# EAGLE design BlackBoard-Artemis-ATP (EAGLE 9.4.0)

## Sheet 1 of 2
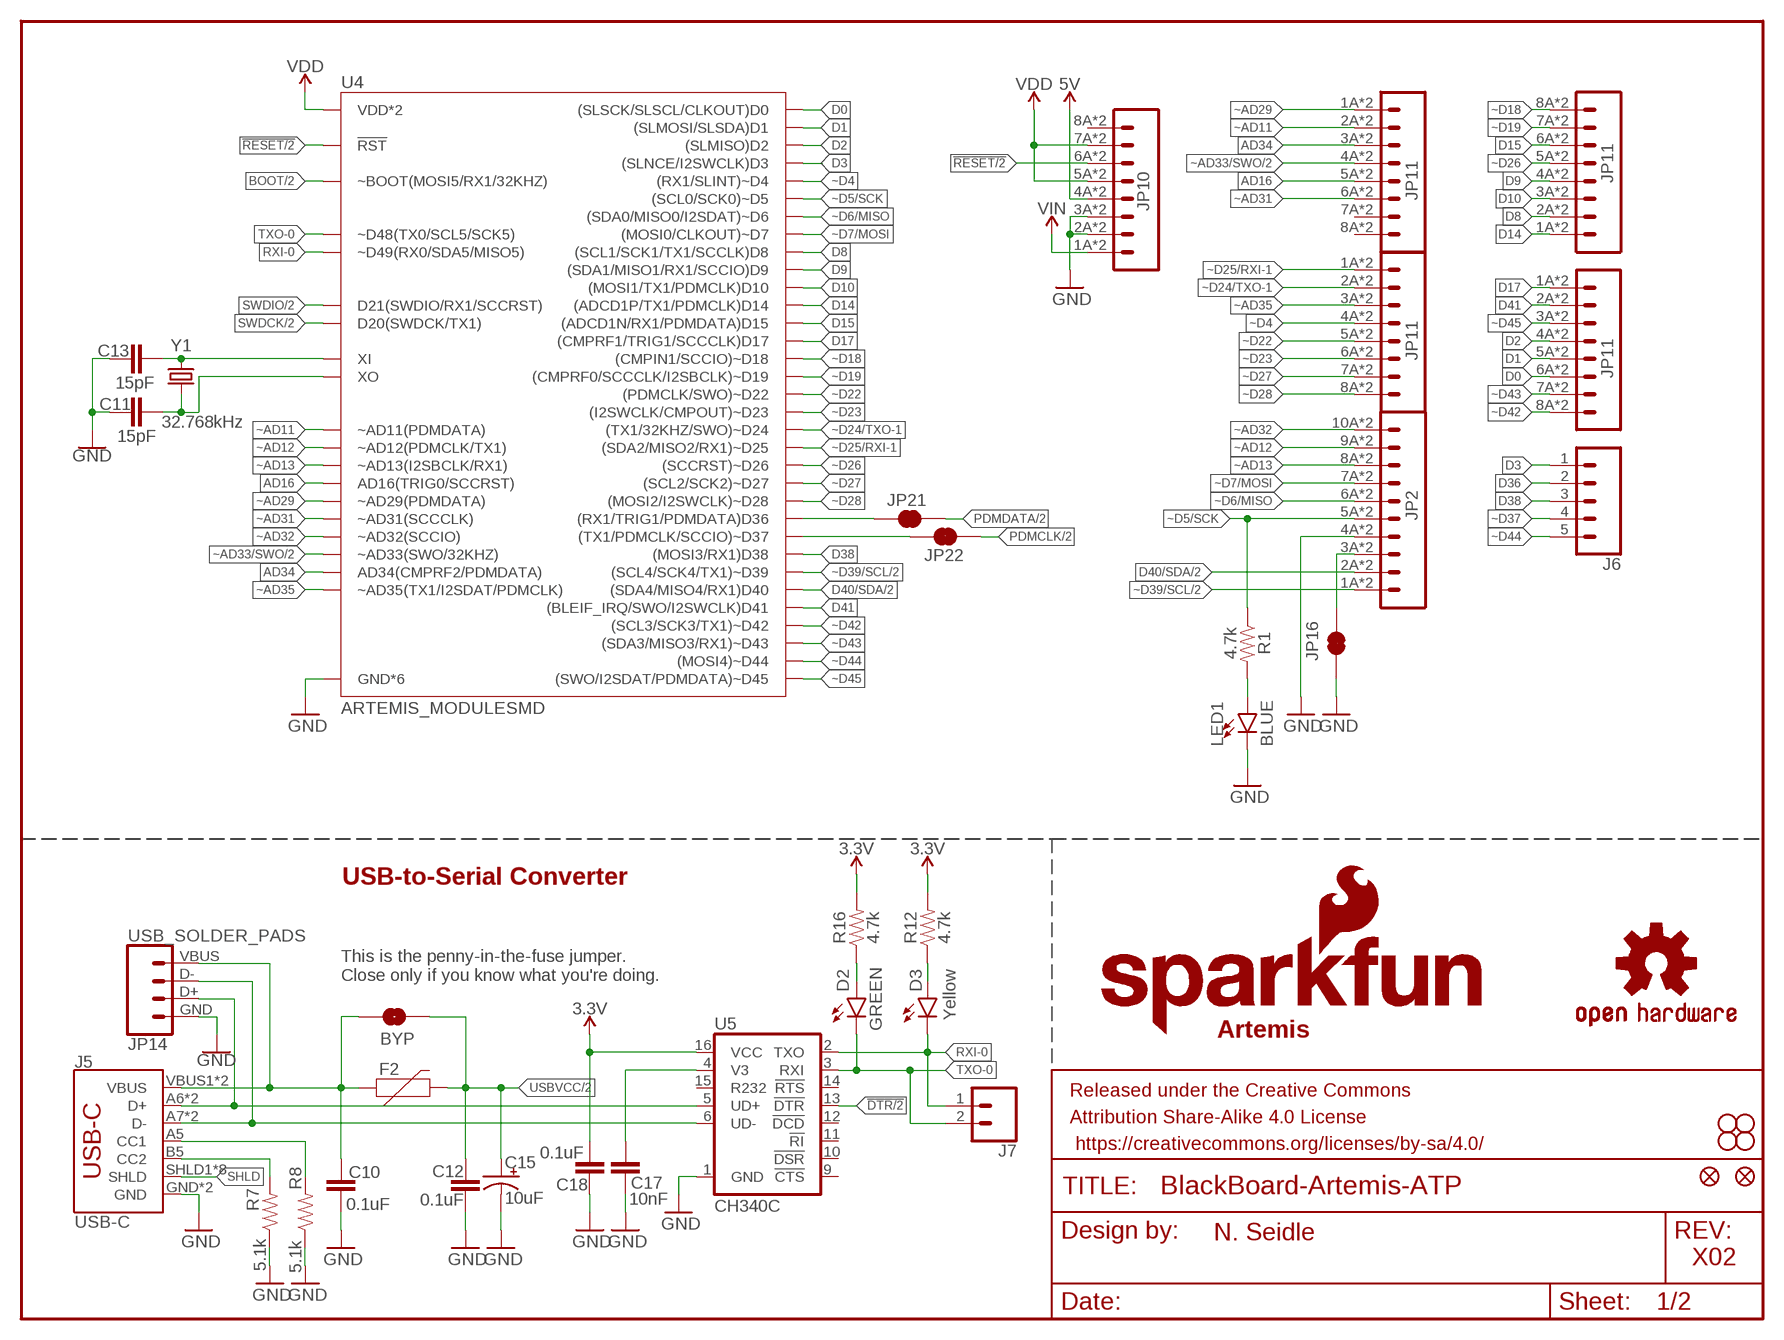
[diagram p0: schematic, sheet 1]

### Parts
BYP  BYP  JUMPER-SMT_2_NO_SILK  [SMT-JUMPER_2_NO_SILK]
C10  0.1uF  0.1UF-0603-25V-(+80/-20%)  [0603]
C11  15pF  15PF-0603-50V-5%  [0603]
C12  0.1uF  0.1UF-0603-25V-(+80/-20%)  [0603]
C13  15pF  15PF-0603-50V-5%  [0603]
C15  10uF  10UF-POLAR-EIA3216-16V-10%(TANT)  [EIA3216]
C17  10nF  10NF-0603-50V-10%  [0603]
C18  0.1uF  0.1UF-0603-25V-(+80/-20%)  [0603]
D2  GREEN  LED-GREENLILYPAD  [LED-1206]
D3  Yellow  LED-YELLOWLILYPAD  [LED-1206]
F2  6V/2A  PPTC_6V2A  [1210]
FRAME1  FRAME-LETTER  [CREATIVE_COMMONS]
J5  USB-C  USB_C  [USB-C-16P]
J6  CONN_05NO_SILK  [1X05_NO_SILK]
J7  CONN_021X02_NO_SILK  [1X02_NO_SILK]
JP1  SFE_LOGO_NAME.1_INCH  [SFE_LOGO_NAME_.1]
JP2  M10SMD_COMBO  [1X10_SMD_COMBINED]
JP3  STAND-OFF  [STAND-OFF]
JP4  STAND-OFF  [STAND-OFF]
JP5  STAND-OFF  [STAND-OFF]
JP6  STAND-OFF  [STAND-OFF]
JP7  SFE_LOGO_FLAME.1_INCH  [SFE_LOGO_FLAME_.1]
JP8  FIDUCIAL1X2  [FIDUCIAL-1X2]
JP9  FIDUCIAL1X2  [FIDUCIAL-1X2]
JP10  M08SMD-COMBO  [1X08_SMD_COMBINED]
JP11  JP11  M08SMD-COMBO  [1X08_SMD_COMBINED]
JP13  JP11  M08SMD-COMBO  [1X08_SMD_COMBINED]
JP14  USB_SOLDER_PADS  [USB-SOLDER-PADS]
JP16  JUMPER-SMT_2_NC_TRACE_SILK  [SMT-JUMPER_2_NC_TRACE_SILK]
JP19  JP11  M08SMD-COMBO  [1X08_SMD_COMBINED]
JP20  JP11  M08SMD-COMBO  [1X08_SMD_COMBINED]
JP21  JUMPER-SMT_2_NC_TRACE_SILK  [SMT-JUMPER_2_NC_TRACE_SILK]
JP22  JUMPER-SMT_2_NC_TRACE_SILK  [SMT-JUMPER_2_NC_TRACE_SILK]
LED1  BLUE  LED-BLUE1206  [LED-1206]
R1  4.7k  4.7KOHM-0603-1/10W-1%  [0603]
R7  5.1k  5.1KOHM5.1KOHM-0603-1/10W-1%  [0603]
R8  5.1k  5.1KOHM5.1KOHM-0603-1/10W-1%  [0603]
R12  4.7k  4.7KOHM-0603-1/10W-1%  [0603]
R16  4.7k  4.7KOHM-0603-1/10W-1%  [0603]
U4  ARTEMIS_MODULESMD  [ARTEMIS_FP]
U5  CH340C  [SO016]
U$16  OSHW-LOGOS  [OSHW-LOGO-S]
Y1  32.768kHz  CRYSTAL-32.768KHZSMD-3.2X1.5  [CRYSTAL-SMD-3.2X1.5MM]

### Nets
3.3V: C18.1 R12.2 R16.2 U5.16(VCC) ; also sheet 2
5V [power]: JP10.4A JP10.4B ; also sheet 2
!DTR: U5.13(!DTR) ; also sheet 2
!RESET: JP10.6A JP10.6B U4.~RST(!RST) ; also sheet 2
AD16: JP13.5A JP13.5B U4.AD16(AD16(TRIG0/SCCRST))
AD34: JP13.3A JP13.3B U4.AD34(AD34(CMPRF2/PDMDATA))
BOOT: U4.BOOT(~BOOT(MOSI5/RX1/32KHZ)) ; also sheet 2
CC1: J5.A5(CC1) R8.2
CC2: J5.B5(CC2) R7.2
D0: JP20.6A JP20.6B U4.D0((SLSCK/SLSCL/CLKOUT)D0)
D1: JP20.5A JP20.5B U4.D1((SLMOSI/SLSDA)D1)
D2: JP20.4A JP20.4B U4.D2((SLMISO)D2)
D3: J6.1 U4.D3((SLNCE/I2SWCLK)D3)
D8: JP19.2A JP19.2B U4.D8((SCL1/SCK1/TX1/SCCLK)D8)
D9: JP19.4A JP19.4B U4.D9((SDA1/MISO1/RX1/SCCIO)D9)
D10: JP19.3A JP19.3B U4.D10((MOSI1/TX1/PDMCLK)D10)
D14: JP19.1A JP19.1B U4.D14((ADCD1P/TX1/PDMCLK)D14)
D15: JP19.6A JP19.6B U4.D15((ADCD1N/RX1/PDMDATA)D15)
D17: JP20.1A JP20.1B U4.D17((CMPRF1/TRIG1/SCCCLK)D17)
D36: J6.2 JP21.1 U4.D36((RX1/TRIG1/PDMDATA)D36)
D38: J6.3 U4.D38((MOSI3/RX1)D38)
D40/SDA: JP2.2A JP2.2B U4.D40((SDA4/MISO4/RX1)D40) ; also sheet 2
D41: JP20.2A JP20.2B U4.D41((BLEIF_IRQ/SWO/I2SWCLK)D41)
D+: J5.A6(D+) J5.B6(D+) JP14.D+ U5.5(UD+)
D-: J5.A7(D-) J5.B7(D-) JP14.D- U5.6(UD-)
GND: C10.2 C11.1 C12.2 C13.1 C15.- C17.2 C18.2 J5.GND J5.GND2(GND) JP2.4A JP2.4B JP10.2A JP10.2B JP10.3A JP10.3B JP14.GND JP16.1 LED1.C R7.1 R8.1 U4.GND@1(GND*6) U4.GND@22(GND*6) U4.GND@38(GND*6) U4.GND@39(GND*6) U4.GND@47(GND*6) U4.GND@59(GND*6) U5.1(GND) ; also sheet 2
N$1: LED1.A R1.2
N$5: D2.A R16.1
N$6: C17.1 U5.4(V3)
N$7: C11.2 U4.XO Y1.P$2
N$8: C13.2 U4.XI Y1.P$1
N$9: D3.A R12.1
N$10: JP2.3A JP2.3B JP16.2
PDMCLK: JP22.2 ; also sheet 2
PDMDATA: JP21.2 ; also sheet 2
RXI-0: D3.C J7.1 U4.RXI-0(~D49(RX0/SDA5/MISO5)) U5.2(TXO)
SHLD: J5.SHLD1(SHLD) J5.SHLD2(SHLD) J5.SHLD3(SHLD) J5.SHLD4(SHLD) J5.SHLD5(SHLD) J5.SHLD6(SHLD) J5.SHLD7(SHLD) J5.SHLD8(SHLD)
SWDCK: U4.SWDCK(D20(SWDCK/TX1)) ; also sheet 2
SWDIO: U4.SWDIO(D21(SWDIO/RX1/SCCRST)) ; also sheet 2
TXO-0: D2.C J7.2 U4.TXO-0(~D48(TX0/SCL5/SCK5)) U5.3(RXI)
USBVCC [power]: BYP.2 C12.1 C15.+ F2.2 ; also sheet 2
VDD: JP10.5A JP10.5B JP10.7A JP10.7B U4.VDD@36(VDD*2) U4.VDD@37(VDD*2) ; also sheet 2
VIN [power]: JP10.1A JP10.1B ; also sheet 2
VUSB [power]: BYP.1 C10.1 F2.1 J5.VBUS1(VBUS) J5.VBUS2(VBUS) JP14.VBUS
~AD11: JP13.2A JP13.2B U4.~AD11(~AD11(PDMDATA))
~AD12: JP2.9A JP2.9B U4.~AD12(~AD12(PDMCLK/TX1))
~AD13: JP2.8A JP2.8B U4.~AD13(~AD13(I2SBCLK/RX1))
~AD29: JP13.1A JP13.1B U4.~AD29(~AD29(PDMDATA))
~AD31: JP13.6A JP13.6B U4.~AD31(~AD31(SCCCLK))
~AD32: JP2.10A JP2.10B U4.~AD32(~AD32(SCCIO))
~AD33/SWO: JP13.4A JP13.4B U4.~AD33/SWO(~AD33(SWO/32KHZ)) ; also sheet 2
~AD35: JP11.3A JP11.3B U4.~AD35(~AD35(TX1/I2SDAT/PDMCLK))
~D4: JP11.4A JP11.4B U4.~D4((RX1/SLINT)~D4)
~D5/SCK: JP2.5A JP2.5B R1.1 U4.~D5((SCL0/SCK0)~D5)
~D6/MISO: JP2.6A JP2.6B U4.~D6((SDA0/MISO0/I2SDAT)~D6)
~D7/MOSI: JP2.7A JP2.7B U4.D7((MOSI0/CLKOUT)~D7)
~D18: JP19.8A JP19.8B U4.~D18((CMPIN1/SCCIO)~D18)
~D19: JP19.7A JP19.7B U4.~D19((CMPRF0/SCCCLK/I2SBCLK)~D19)
~D22: JP11.5A JP11.5B U4.~D22((PDMCLK/SWO)~D22)
~D23: JP11.6A JP11.6B U4.~D23((I2SWCLK/CMPOUT)~D23)
~D24/TXO-1: JP11.2A JP11.2B U4.~D24((TX1/32KHZ/SWO)~D24)
~D25/RXI-1: JP11.1A JP11.1B U4.~D25((SDA2/MISO2/RX1)~D25)
~D26: JP19.5A JP19.5B U4.~D26((SCCRST)~D26)
~D27: JP11.7A JP11.7B U4.~D27((SCL2/SCK2)~D27)
~D28: JP11.8A JP11.8B U4.~D28((MOSI2/I2SWCLK)~D28)
~D37: J6.4 JP22.1 U4.~D37((TX1/PDMCLK/SCCIO)~D37)
~D39/SCL: JP2.1A JP2.1B U4.~D39((SCL4/SCK4/TX1)~D39) ; also sheet 2
~D42: JP20.8A JP20.8B U4.~D42((SCL3/SCK3/TX1)~D42)
~D43: JP20.7A JP20.7B U4.~D43((SDA3/MISO3/RX1)~D43)
~D44: J6.5 U4.~D44((MOSI4)~D44)
~D45: JP20.3A JP20.3B U4.~D45((SWO/I2SDAT/PDMDATA)~D45)
Unconnected: JP10.8A JP10.8B JP13.7A JP13.7B JP13.8A JP13.8B U5.9(!CTS) U5.10(!DSR) U5.11(!RI) U5.12(!DCD) U5.14(!RTS) U5.15(R232)

### Notes on the sheet
- USB-to-Serial Converter
- This is the penny-in-the-fuse jumper.
  Close only if you know what you're doing.
- Artemis
- N. Seidle
- X02

## Sheet 2 of 2
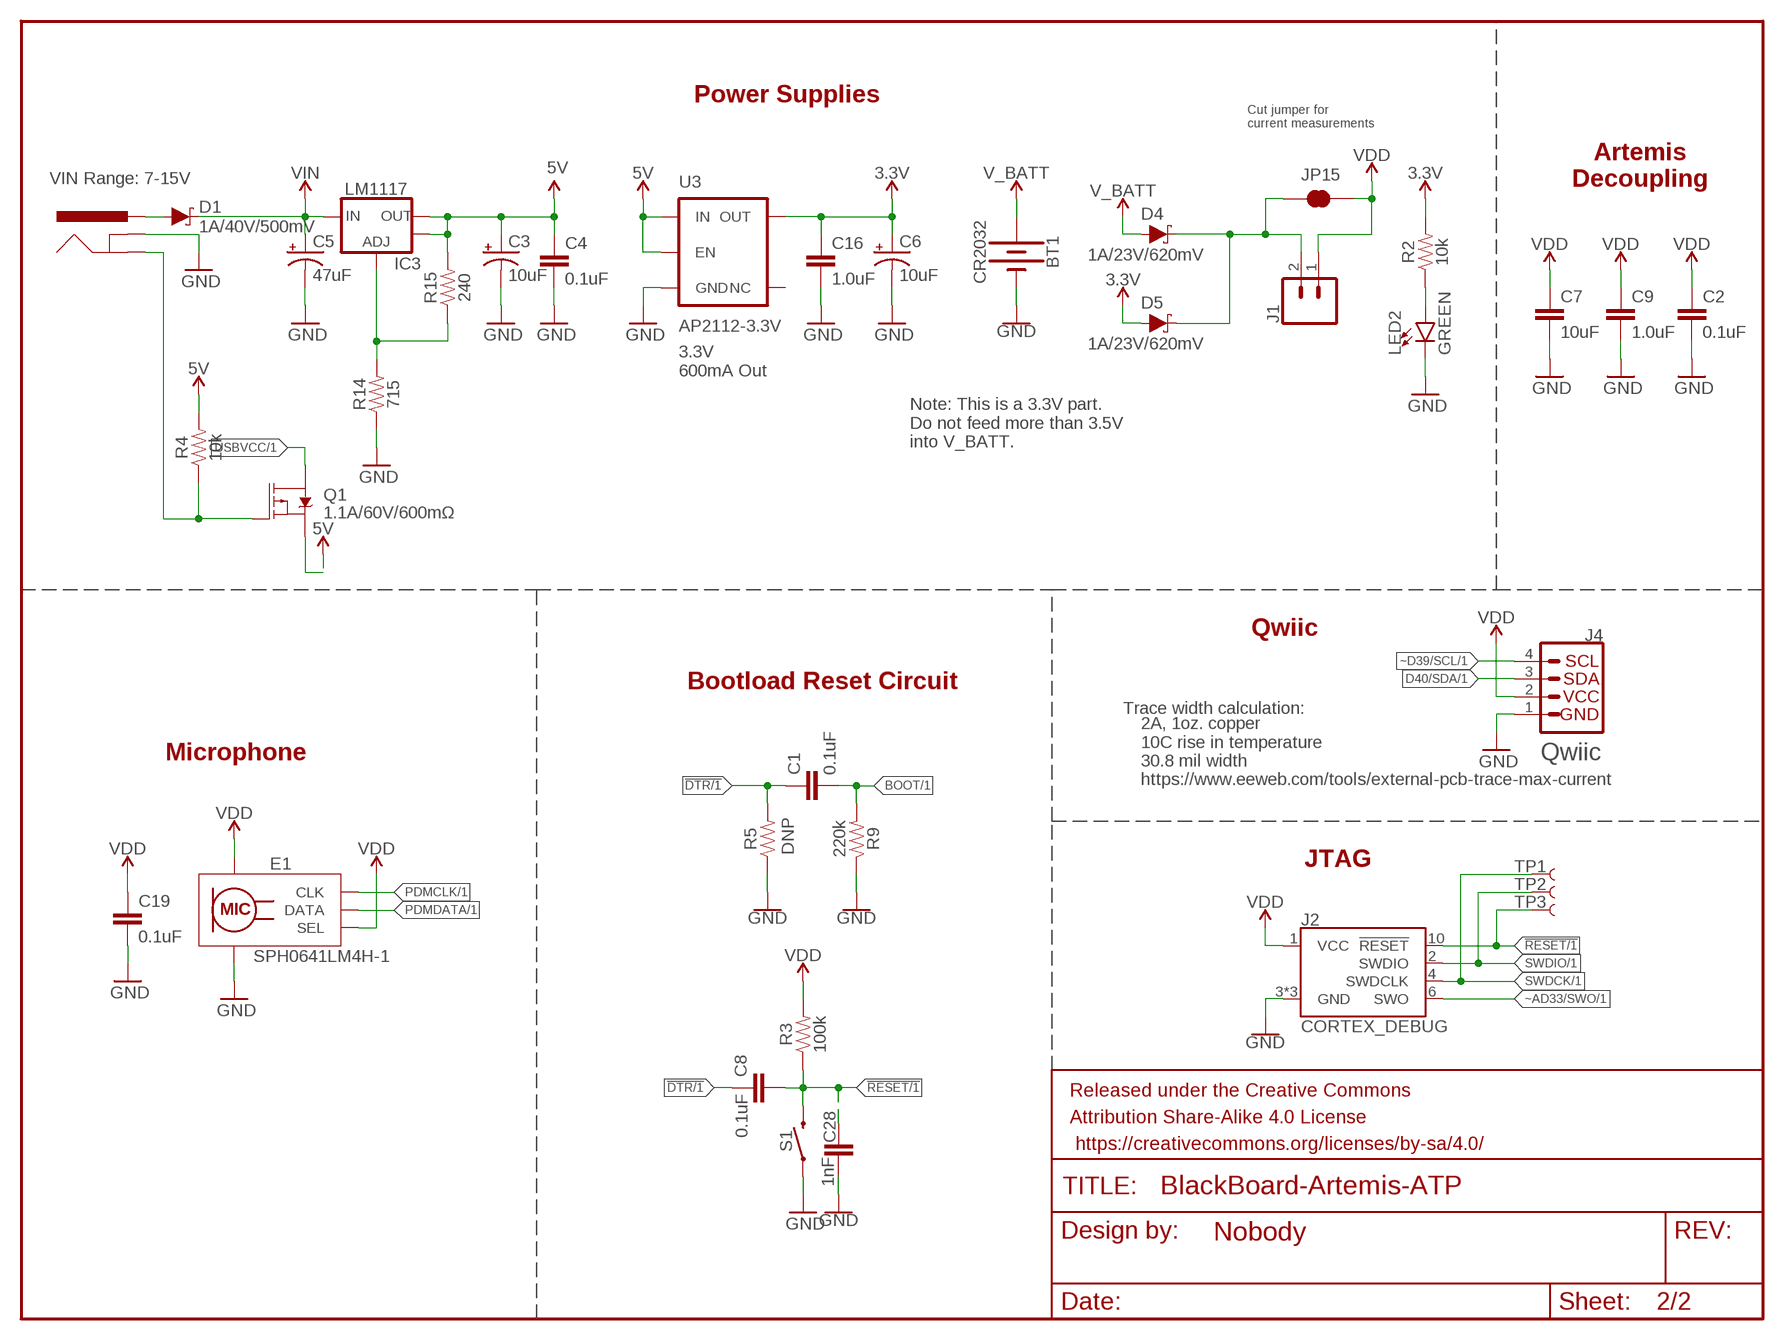
[diagram p1: schematic, sheet 2]

### Parts
BT1  CR2032  BATTERY-20MM_SMD_4LEGS_OVERPASTE  [BATTCON_20MM_4LEGS_OVERPASTE]
C1  0.1uF  0.1UF-0603-25V-5%  [0603]
C2  0.1uF  0.1UF-0603-25V-(+80/-20%)  [0603]
C3  10uF  10UF-POLAR-EIA3216-16V-10%(TANT)  [EIA3216]
C4  0.1uF  0.1UF-0603-25V-(+80/-20%)  [0603]
C5  47uF  47UF-POLAR-PANASONIC_D-35V-20%  [PANASONIC_D]
C6  10uF  10UF-POLAR-EIA3216-16V-10%(TANT)  [EIA3216]
C7  10uF  10UF-0603-6.3V-20%  [0603]
C8  0.1uF  0.1UF-0603-25V-5%  [0603]
C9  1.0uF  1.0UF-0603-16V-10%  [0603]
C16  1.0uF  1.0UF-0603-16V-10%  [0603]
C19  0.1uF  0.1UF-0603-25V-(+80/-20%)  [0603]
C28  1nF  1.0NF/1000PF-0603-50V-10%  [0603]
D1  1A/40V/500mV  DIODE-SCHOTTKY-SS14  [SMA-DIODE]
D4  1A/23V/620mV  DIODE-SCHOTTKY-BAT20J  [SOD-323]
D5  1A/23V/620mV  DIODE-SCHOTTKY-BAT20J  [SOD-323]
E1  SPH0641LM4H-1  SPH0641LM4H-1_MICROPHONE  [SPH0641LM4H-1_MICROPHONE]
FRAME2  FRAME-LETTERNO_PACKAGE  [DUMMY]
IC3  LM1117  V_REG_LM1117ALT1  [SOT223-ALT1]
J1  CONN_021X02_NO_SILK  [1X02_NO_SILK]
J2  CORTEX_DEBUG  CORTEX_DEBUG_MINIMUM_PTH_NS  [2X5-PTH-1.27MM-NO_SILK]
J3  POWER_JACKTOE  [POWER_JACK_SMD_OVERPASTE_TOE]
J4  QWIIC_CONNECTORJS-1MM  [JST04_1MM_RA]
JP15  JUMPER-SMT_2_NC_TRACE_SILK  [SMT-JUMPER_2_NC_TRACE_SILK]
LED2  GREEN  LED-GREENLILYPAD  [LED-1206]
Q1  1.1A/60V/600mΩ  MOSFET_PCH-SI2309DS  [SOT23-3]
R2  10k  10KOHM-0603-1/10W-1%  [0603]
R3  100k  100KOHM-0603-1/10W-1%  [0603]
R4  10k  10KOHM-0603-1/10W-1%  [0603]
R5  RESISTOR0603  [0603]
R9  220k  220KOHM-0603-1/10W-1%  [0603]
R14  715  715OHM-0603-1/10W-1%  [0603]
R15  240  240OHM-0603-1/10W-1%  [0603]
S1  MOMENTARY-SWITCH-SPST-SMD-5.2-TALL-REDUNDANT  [TACTILE_SWITCH_SMD_5.2MM]
TP1  TEST-POINT3X5  [PAD.03X.05]
TP2  TEST-POINT3X5  [PAD.03X.05]
TP3  TEST-POINT3X5  [PAD.03X.05]
U3  AP2112-3.3V  V_REG_AP2112K-3.3V  [SOT23-5]

### Nets
3.3V: C6.+ C16.1 D5.A R2.2 U3.5(OUT) ; also sheet 1
5V [power]: C3.+ C4.1 IC3.2(OUT) IC3.4(OUT) Q1.2(S) R4.2 R15.2 U3.1(IN) U3.3(EN) ; also sheet 1
!DTR: C1.1 C8.1 R5.2 ; also sheet 1
!RESET: C8.2 C28.1 J2.10(!RESET) R3.1 S1.3 S1.4 TP3.P$1 ; also sheet 1
BOOT: C1.2 R9.2 ; also sheet 1
D40/SDA: J4.3 ; also sheet 1
GND: BT1.2(-) C2.1 C3.- C4.2 C5.- C6.- C7.2 C9.2 C16.2 C19.2 C28.2 E1.3(GND) E1.6(GND) E1.7(GND) E1.8(GND) J2.3(GND) J2.5(GND) J2.9(GND) J3.GND(GNDBREAK) J4.1 LED2.C R5.1 R9.1 R14.1 S1.1 S1.2 U3.2(GND) ; also sheet 1
INSERT: J3.P$4(GND) Q1.1(G) R4.1
N$2: LED2.A R2.1
N$3: D4.C D5.C J1.2 JP15.1
N$15: IC3.1(ADJ) R14.2 R15.1
PDMCLK: E1.4(CLK) ; also sheet 1
PDMDATA: E1.1(DATA) ; also sheet 1
PWRIN [power]: D1.A J3.VIN0(PWR)
SWDCK: J2.4(SWDCLK) TP1.P$1 ; also sheet 1
SWDIO: J2.2(SWDIO) TP2.P$1 ; also sheet 1
USBVCC [power]: Q1.3(D) ; also sheet 1
V_BATT: BT1.1(+) D4.A
VDD: C2.2 C7.1 C9.1 C19.1 E1.2(SEL) E1.5(VDD) J1.1 J2.1(VCC) J4.2 JP15.2 R3.2 ; also sheet 1
VIN [power]: C5.+ D1.C IC3.3(IN) ; also sheet 1
~AD33/SWO: J2.6(SWO) ; also sheet 1
~D39/SCL: J4.4 ; also sheet 1
Unconnected: U3.4(NC)

### Notes on the sheet
- Power Supplies
- Cut jumper for
  current measurements
- Artemis
  Decoupling
- VIN Range: 7-15V
- 3.3V
  600mA Out
- Note: This is a 3.3V part.
  Do not feed more than 3.5V
  into V_BATT.
- Qwiic
- Bootload Reset Circuit
- Trace width calculation:
- Microphone
- Qwiic
- 2A, 1oz. copper
  10C rise in temperature
  30.8 mil width
  https://www.eeweb.com/tools/external-pcb-trace-max-current
- DNP | JTAG

## Library data of the parts
BT1 = SparkFun-Batteries:BATTERY: Battery - Single Cell A variety of battery chemistries, sizes, and footprints. Device List: 20MM_PTH - Coin Cell Battery Holder - 20mm (PTH) <https://www.sparkfun.com/products/783> 20MM_PTH_KIT- Coin Cell battery Holder - 20 mm (PTH) <http://www.sparkfun.com/products/783>kit version with special mask 6.8MM_PTH - Coin Cell Battery Holder - 6.8MM(SMD) <https://www.digikey.com/product-detail/en/seiko-instruments/MS621FE-FL11E/728-1057-ND/1889208?WT.srch=1&gclid=CNOQ5a6LzdQCFZS2wAodXCkE0g> 12MM_SMD - Coin Cell Battery Holder - 12mm (SMD) <https://www.sparkfun.com/products/10592> 12MM_PTH - Coin Cell Battery Holder - 12mm (PTH) <https://www.sparkfun.com/products/7948> 20MM_SMD - 20mm Coin Cell Battery Holder (SMD) (2 legs) Used on the Big Time Watch Kit <https://www.sparkfun.com/products/11734> 20MM_SMD_4LEGS - Coin Cell Battery Holder - 20mm (SMD) <https://www.sparkfun.com/products/11892> 20MM_SMD_4LEGS_OVERPASTE - Coin Cell Battery Holder - 20mm (SMD) <https://www.sparkfun.com/products/11892> (Over-paste on the legs) 24.5MM_PTH - Coin Cell Battery Holder - 24.5mm (PTH) <https://www.sparkfun.com/products/8863> 9V - 9V Battery Holder - PC Mount Used on the SparkFun SparkPunk Sound Kit <https://www.sparkfun.com/products/11177> and SparkFun SparkPunk Sequencer Kit <https://www.sparkfun.com/products/12707> 18650 - Battery Holder - 18650 (PTH) <https://www.sparkfun.com/products/13113> AA - Battery Holder - 1xAA (PTH) <https://www.sparkfun.com/products/7949> AAA - Battery Holder - 1xAAA (PTH) <https://www.sparkfun.com/products/12718> AA_KIT - Battery Holder - 1xAA (PTH) <https://www.sparkfun.com/products/7949> Special kit package - pads only have exposed copper on one side of the board. AAA_KIT - Battery Holder - 1xAAA (PTH) <https://www.sparkfun.com/products/12718> Special kit package - pads only have exposed copper on one side of the board.; PROD_ID: PRT-11892; SF_SKU: BATT-10373
BYP = SparkFun-Jumpers:JUMPER-SMT_2_NO: Normally open jumper This jumper has two pads in close proximity to each other. Apply solder to close the connection. Round pads are easier to solder for beginners, but are a lot larger. SparkFun Product that uses the round pads: SparkFun EL Sequencer <https://www.sparkfun.com/products/12781>
C1 C8 = SparkFun-Capacitors:0.1UF: 0.1µF ceramic capacitors A capacitor is a passive two-terminal electrical component used to store electrical energy temporarily in an electric field.; PROD_ID: CAP-08604
C2 C4 C10 C12 C18 C19 = SparkFun-Capacitors:0.1UF: 0.1µF ceramic capacitors A capacitor is a passive two-terminal electrical component used to store electrical energy temporarily in an electric field.; PROD_ID: CAP-00810
C3 C6 C15 = SparkFun-Capacitors:10UF-POLAR: 10.0µF polarized capacitors A capacitor is a passive two-terminal electrical component used to store electrical energy temporarily in an electric field.; PROD_ID: CAP-00811
C5 = SparkFun-Capacitors:47UF-POLAR: 47µF polarized capacitors A capacitor is a passive two-terminal electrical component used to store electrical energy temporarily in an electric field.; PROD_ID: CAP-08478
C7 = SparkFun-Capacitors:10UF: 10.0µF ceramic capacitors A capacitor is a passive two-terminal electrical component used to store electrical energy temporarily in an electric field.; PROD_ID: CAP-11015
C9 C16 = SparkFun-Capacitors:1.0UF: 1µF ceramic capacitors A capacitor is a passive two-terminal electrical component used to store electrical energy temporarily in an electric field.; PROD_ID: CAP-00868
C11 C13 = SparkFun-Capacitors:15PF: 15pF ceramic capacitors A capacitor is a passive two-terminal electrical component used to store electrical energy temporarily in an electric field.; PROD_ID: CAP-07881
C17 = SparkFun-Capacitors:10NF: 0.01uF/10nF/10,000pF ceramic capacitors A capacitor is a passive two-terminal electrical component used to store electrical energy temporarily in an electric field. CAP-09321; PROD_ID: CAP-00867
C28 = SparkFun-Capacitors:1.0NF/1000PF: 1nF/1,000pF ceramic capacitors A capacitor is a passive two-terminal electrical component used to store electrical energy temporarily in an electric field.; PROD_ID: CAP-07886
D1 = SparkFun-DiscreteSemi:DIODE-SCHOTTKY: Schottky diode A Schottky diode is a semiconductor diode which has a low forward voltage drop and a very fast switching action.; PROD_ID: DIO-08053
D2 LED2 = SparkFun-LED:LED-GREEN: Green SMD LED Used in manufacturing of various products at SparkFun Packages: 0603 - SMD 0603 package [Product Link] <http://www.futureelectronics.com/en/technologies/semiconductors/optoelectronics/leds/Pages/9894312-LTST-C190GKT.aspx?CrossPart=HSMG-C190&IM=0> LilyPad 1206 - SMD1206 LilyPad package [Product Link] <http://www.futureelectronics.com/en/Technologies/Product.aspx?ProductID=IN150NGHARVATEKCORPORATION2049943&IM=0> 1206 - SMD1206 package [Product Link] <http://www.futureelectronics.com/en/technologies/semiconductors/optoelectronics/leds/Pages/8315665-LTST-C150KGKT.aspx?IM=0> 1206 Bottom Mount -SMD 1206 Bottom Mount [Product Link] <http://www.digikey.com/product-detail/en/lite-on-inc/LTST-C230KGKT/160-1456-1-ND/386854> SparkFun Products: Pro Mini 328 -5V <https://www.sparkfun.com/products/821> RedBoard <https://www.sparkfun.com/products/12757> MP3 Trigger <https://www.sparkfun.com/products/13720> Makey Makey <https://www.sparkfun.com/products/11076>; PROD_ID: DIO-09910
D3 = SparkFun-LED:LED-YELLOW: Yellow SMD LED Used in manufacturing several products at SparkFun. Packages: 0603 - SMD 0603 package[Product Link] <http://www.kingbrightusa.com/product.asp?catalog_name=LED&product_id=APT1608SYCK> 0603 -SMART - SMART SMD 0603 package (more efficient/more expensive) [Product Link] <http://www.osram-os.com/osram_os/en/products/product-catalog/led-light-emitting-diodes/smartled-0603/ly-l29k/index.jsp> LilyPad - SMD1206 package[Product Datasheet] <https://www.sparkfun.com/datasheets/DevTools/LilyPad/Q150YUS4.pdf> SparkFun Products: Blynk Board <https://www.sparkfun.com/products/13794> IOIO-OTG <https://www.sparkfun.com/products/13613> XBee Explorer Serial <https://www.sparkfun.com/products/13225>; PROD_ID: DIO-09909
D4 D5 = SparkFun-DiscreteSemi:DIODE-SCHOTTKY: Schottky diode A Schottky diode is a semiconductor diode which has a low forward voltage drop and a very fast switching action.; PROD_ID: DIO-11623
E1 = SparkFun-Sensors:SPH0641LM4H-1_MICROPHONE: SPH0641LM4H-1 Microphone A miniature, high-performance, low power, bottom port silicon digital microphone with a single bit PDM output.; PROD_ID: IC-14361
F2 = SparkFun-Fuses:PPTC: Resettable Fuse PPTC Resettable Fuse. Really a sort of resistor with a polymeric positive temperature coefficient whose resistance increases dramatically with an increase in temperature. When heated by the power passing through the resistance rises causing the current to be limited, protecting the circuit. This is achieved by the transition of the polymer from a crystalline to an amorphous state where the conductive carbon separates breaking the conductive pathways found in the cool crystalline structure. When a PPTC cools back down it resumes conducting letting the circuit turn back on. SparkFun Products: SparkFun RedBoard - Programmed with Arduino <https://www.sparkfun.com/products/12757> Pro Micro - 5V/16MHz <https://www.sparkfun.com/products/12640> Arduino Pro 328 - 5V/16MHz <https://www.sparkfun.com/products/10915> MP3 Trigger <https://www.sparkfun.com/products/13720>; PROD_ID: RES-14313
FRAME1 = SparkFun-Aesthetics:FRAME-LETTER: Schematic Frame - Letter Standard 8.5x11 US Letter frame
FRAME2 = SparkFun-Aesthetics:FRAME-LETTER: Schematic Frame - Letter Standard 8.5x11 US Letter frame; DESIGNER: Nobody; VERSION: v01
IC3 = Testing:V_REG_LM1117: Voltage Regulator LM1117 Standard adjustable voltage regulator but in SMD form. Spark Fun Electronics SKU : COM-00595; PROD_ID: VREG-08170
J1 J7 = SparkFun-Connectors:CONN_02: Multi connection point. Often used as Generic Header-pin footprint for 0.1 inch spaced/style header connections On any of the 0.1 inch spaced packages, you can populate with these: Break Away Headers - Straight <https://www.sparkfun.com/products/116> (PRT-00116) Break Away Male Headers - Right Angle <https://www.sparkfun.com/products/553> (PRT-00553) Female Headers <https://www.sparkfun.com/products/115> (PRT-00115) Break Away Headers - Machine Pin <https://www.sparkfun.com/products/117> (PRT-00117) Break Away Female Headers - Swiss Machine Pin <https://www.sparkfun.com/products/743> (PRT-00743) For SCREWTERMINALS and SPRING TERMINALS visit here: Screw Terimnals on SparkFun.com <https://www.sparkfun.com/search/results?term=Screw+Terminals> (5mm/3.5mm/2.54mm spacing) This device is also useful as a general connection point to wire up your design to another part of your project. Our various solder wires solder well into these plated through hole pads. Hook-Up Wire - Assortment (Stranded, 22 AWG) <https://www.sparkfun.com/products/11375> (PRT-11375) Hook-Up Wire - Assortment (Solid Core, 22 AWG) <https://www.sparkfun.com/products/11367> (PRT-11367) View the entire wire category on our website here <https://www.sparkfun.com/categories/141> Special notes: Molex polarized connector foot print use with: PRT-08233 with associated crimp pins and housings. 2.54_SCREWTERM for use with PRT-10571. 3.5mm Screw Terminal footprints for PRT-08084 5mm Screw Terminal footprints for use with PRT-08432
J2 = SparkFun-Connectors:CORTEX_DEBUG_MINIMUM: Cortex Debug Connector - 10 pin Supports JTAG debug, Serial Wire debug, and Serial Wire Viewer. PTH and SMD connector options available. General Connector Information <http://infocenter.arm.com/help/topic/com.arm.doc.faqs/attached/13634/cortex_debug_connectors.pdf> Products: PTH Connector <http://www.digikey.com/product-detail/en/cnc-tech/3220-10-0100-00/1175-1627-ND/3883661> -via Digi-Key SparkFun PSoc <https://www.sparkfun.com/products/13229> SparkFun T <https://www.sparkfun.com/products/13810>
J3 = SparkFun-Connectors:POWER_JACK: Power Jack Connector This is the standard 5.5mm barrel jack for power. The PTH is the most common, proven, reliable, footprint. The Slot footprint only works if the mill layer is transmitted to the PCB fab house so be warned. Here are the connectors we sell at SparkFun: DC Barrel Power Jack/Connector <https://www.sparkfun.com/products/119> (PRT-00119) DC Barrel Power Jack/Connector (SMD) <https://www.sparkfun.com/products/12748> (PRT-12748) DC Barrel Jack Adapter - Breadboard Compatible <https://www.sparkfun.com/products/10811> (PRT-10811) It is used on this SparkFun product (and many, many others): SparkFun RedBoard - Programmed with Arduino <https://www.sparkfun.com/products/12757> (DEV-12757) Also, if you need a mating power supply or connector, please check these out: Wall Adapter Power Supply - 9VDC 650mA <https://www.sparkfun.com/products/298> (TOL-00298) DC Barrel Jack Adapter - Male <https://www.sparkfun.com/products/10287> (PRT-10287); PROD_ID: CONN-08106; SF_ID: PRT-12748
J4 = SparkFun-Connectors:QWIIC_CONNECTOR: SparkFun I2C Standard Qwiic Connector An SMD 1mm pitch JST connector makes it easy and quick (get it? Qwiic?) to connect I2C devices to each other. The Qwiic system <http://www.sparkfun.com/qwiic> enables fast and solderless connection between popular platforms and various sensors and actuators. We carry 200mm <https://www.sparkfun.com/products/14204>, 100mm <https://www.sparkfun.com/products/14205>, 50mm <https://www.sparkfun.com/products/14206>, and breadboard friendly <https://www.sparkfun.com/products/14207> Qwiic cables. We also offer 10 pcs strips <https://www.sparkfun.com/products/14323> the SMD connectors.; PROD_ID: CONN-13694
J5 = SparkFun-Connectors:USB_C: USB Type C 16Pin Connector Super Speed pins not available on the 16-pin purely SMD connector so this part is best for USB 2.0 implementations. D1 and D2 are tied together enabling D+/- no matter which way the cable is plugged into the connector. The two channel configuration pins (CC1/2) are exposed. These are normally connected to ground via 5.1k resistors but can be reconfigured for high current/high power applications.; PROD_ID: CONN-14122; VALUE: USB Female Type C Connector
J6 = SparkFun-Connectors:CONN_05: Multi connection point. Often used as Generic Header-pin footprint for 0.1 inch spaced/style header connections On any of the 0.1 inch spaced packages, you can populate with these: Break Away Headers - Straight <https://www.sparkfun.com/products/116> (PRT-00116) Break Away Male Headers - Right Angle <https://www.sparkfun.com/products/553> (PRT-00553) Female Headers <https://www.sparkfun.com/products/115> (PRT-00115) Break Away Headers - Machine Pin <https://www.sparkfun.com/products/117> (PRT-00117) Break Away Female Headers - Swiss Machine Pin <https://www.sparkfun.com/products/743> (PRT-00743) For SCREWTERMINALS and SPRING TERMINALS visit here: Screw Terimnals on SparkFun.com <https://www.sparkfun.com/search/results?term=Screw+Terminals> (5mm/3.5mm/2.54mm spacing) This device is also useful as a general connection point to wire up your design to another part of your project. Our various solder wires solder well into these plated through hole pads. Hook-Up Wire - Assortment (Stranded, 22 AWG) <https://www.sparkfun.com/products/11375> (PRT-11375) Hook-Up Wire - Assortment (Solid Core, 22 AWG) <https://www.sparkfun.com/products/11367> (PRT-11367) View the entire wire category on our website here <https://www.sparkfun.com/categories/141> Special notes: Molex polarized connector foot print use with SKU : PRT-08231 with associated crimp pins and housings. 1MM SMD Version SKU: PRT-10208
JP1 = SparkFun-Aesthetics:SFE_LOGO_NAME: SparkFun Font Logo This is the SparkFun name logo. The logo on the schematic will always be the same size; the package variant is the height of the flame part of the logo (or the height the flame would be, if it were drawn). Default layer for the logo on the board is tSilk.
JP2 = SparkFun-Connectors:M10: Header 10 Standard 10-pin 0.1" header. Use with straight break away headers (SKU : PRT-00116), right angle break away headers (PRT-00553), swiss pins (PRT-00743), machine pins (PRT-00117), and female headers (PRT-00115).; PROD_ID: CONN-11219
JP3-JP6 = SparkFun:STAND-OFF: Stand Off This is the mechanical footprint for a #4 phillips button head screw. Use the keepout ring to avoid running the screw head into surrounding components. SKU : PRT-00447
JP7 = SparkFun-Aesthetics:SFE_LOGO_FLAME: SparkFun Flame Logo This is the SparkFun flame logo. The logo on the schematic will always be the same size; the package variant is the height of the flame. Default layer for the logo on the board is tSilk.
JP8 JP9 = SparkFun:FIDUCIAL: Fiducial Alignment Points Various fiducial points for machine vision alignment.
JP10 JP11 JP13 JP19 JP20 = SparkFun-Connectors:M08: Header 8 Standard 8-pin 0.1" header. Use with straight break away headers (SKU : PRT-00116), right angle break away headers (PRT-00553), swiss pins (PRT-00743), machine pins (PRT-00117), and female headers (PRT-00115).; PROD_ID: CONN-10204
JP14 = SparkFun-Connectors:USB_SOLDER_PADS: Solder pad access to USB pins. Helpful to expose on PCBs so user can attach external USB connector if necessary.
JP15 JP16 JP21 JP22 = SparkFun-Jumpers:JUMPER-SMT_2_NC_TRACE: Normally closed trace jumper This jumper has a trace between two pads so it's normally closed (NC). Use a razor knife to open the connection. For best results follow the IPC guidelines for cutting traces: Cutout at least 0.063 mm (0.005 in). Remove all loose material to clean up the cut area. Seal the cut with an approved epoxy. Reapply solder to reclose the connection.
LED1 = SparkFun-LED:LED-BLUE: Blue SMD LED Used in manufacturing of various products at SparkFun Packages: 0603 - SMD 0603 package [Product Link] <http://www.digikey.com/product-detail/en/SMLE12BC7TT86/511-1589-2-ND/1641808> 1206 - SMD1206 package [Product Link] <http://www.digikey.com/product-detail/en/lite-on-inc/LTST-C150TBKT/160-1643-1-ND/573584> SparkFun Products: ESP8266 Thing-Dev Board <https://www.sparkfun.com/products/13711> RedBoard <https://www.sparkfun.com/products/12757>; PROD_ID: DIO-09911
Q1 = SparkFun-DiscreteSemi:MOSFET_PCH: P-channel MOSFETs Voltage controlled devices that allow control of high current outputs. SparkFun Products: SparkFun ESP32 Thing <https://www.sparkfun.com/products/13907> SparkFun ESP8266 Thing <https://www.sparkfun.com/products/13231> SparkFun Pi Servo HAT V2 <https://www.sparkfun.com/products/15316> DMG2305UX-7 (20V/4.2A/SOT23-3); PROD_ID: TRANS-08285
R1 R12 R16 = SparkFun-Resistors:4.7KOHM: 4.7kΩ resistor A resistor is a passive two-terminal electrical component that implements electrical resistance as a circuit element. Resistors act to reduce current flow, and, at the same time, act to lower voltage levels within circuits. - Wikipedia; PROD_ID: RES-07857
R2 R4 = SparkFun-Resistors:10KOHM: 10kΩ resistor A resistor is a passive two-terminal electrical component that implements electrical resistance as a circuit element. Resistors act to reduce current flow, and, at the same time, act to lower voltage levels within circuits. - Wikipedia; PROD_ID: RES-00824
R3 = SparkFun-Resistors:100KOHM: 100kΩ resistor A resistor is a passive two-terminal electrical component that implements electrical resistance as a circuit element. Resistors act to reduce current flow, and, at the same time, act to lower voltage levels within circuits. - Wikipedia; PROD_ID: RES-07828
R5 = SparkFun-Resistors:RESISTOR: Generic Resistor Package
R7 R8 = SparkFun-Resistors:5.1KOHM; PROD_ID: RES-12083
R9 = SparkFun-Resistors:220KOHM: 220kΩ resistor A resistor is a passive two-terminal electrical component that implements electrical resistance as a circuit element. Resistors act to reduce current flow, and, at the same time, act to lower voltage levels within circuits. - Wikipedia; PROD_ID: RES-08969
R14 = SparkFun-Resistors:715OHM: 715Ω resistor A resistor is a passive two-terminal electrical component that implements electrical resistance as a circuit element. Resistors act to reduce current flow, and, at the same time, act to lower voltage levels within circuits. - Wikipedia; PROD_ID: RES-07850
R15 = SparkFun-Resistors:240OHM: 240Ω resistor A resistor is a passive two-terminal electrical component that implements electrical resistance as a circuit element. Resistors act to reduce current flow, and, at the same time, act to lower voltage levels within circuits. - Wikipedia; PROD_ID: RES-07849
S1 = SparkFun-Switches:MOMENTARY-SWITCH-SPST: Momentary Switch (Pushbutton) - SPST Normally-open (NO) SPST momentary switches (buttons, pushbuttons). Variants PTH-12MM - 12mm square, through-hole Momentary Pushbutton Switch - 12mm Square <https://www.sparkfun.com/products/9190> (COM-09190) PTH-6.0MM, PTH-6.0MM-KIT - 6.0mm square, through-hole Mini Pushbutton Switch <https://www.sparkfun.com/products/97> (COM-00097) KIT package intended for soldering kit's - only one side of pads' copper is exposed. PTH-RIGHT-ANGLE-KIT - Right-angle, through-hole Right Angle Tactile Button <https://www.sparkfun.com/products/10791> - Used on SparkFun BigTime Watch Kit <https://www.sparkfun.com/products/11734> SMD-12MM - 12mm square, surface-mount Tactile Button - SMD (12mm) <https://www.sparkfun.com/products/12993> (COM-12993) Used on SparkFun PicoBoard <https://www.sparkfun.com/products/11888> SMD-4.5MM - 4.5mm Square Trackball Switch Used on SparkFun Blackberry Trackballer Breakout <https://www.sparkfun.com/products/13169> SMD-4.6MMX2.8MM - 4.60mm x 2.80mm, surface mount Used on SparkFun SAMD21 Mini Breakout <https://www.sparkfun.com/products/13664> SMD-5.2MM, SMD-5.2-REDUNDANT - 5.2mm square, surface-mount Mini Pushbutton Switch - SMD <https://www.sparkfun.com/products/8720> (COM-08720) Used on Arduino Pro Mini <https://www.sparkfun.com/products/11114> REDUNDANT package connects both switch circuits together SMD-6.0X3.5MM - 6.0 x 3.5mm, surface mount Momentary Reset Switch SMD <https://www.sparkfun.com/products/8229> (COM-08229) SMD-6.2MM-TALL - 6.2mm square, surface mount Tactile Button - SMD (6mm) <https://www.sparkfun.com/products/12992> Used on SparkFun Digital Sandbox <https://www.sparkfun.com/products/12651> SMD-RIGHT-ANGLE - Right-angle, surface mount Used on SparkFun Block for Intel® Edison - Arduino <https://www.sparkfun.com/products/13036>; PROD_ID: SWCH-14139
TP1-TP3 = SparkFun-Connectors:TEST-POINT: SparkFun Test Points Bare copper test points for troubleshooting or In-Circuit-Testing. These are used by our Production team for verifying production board runs using pogo-pins on test beds. SparkFun Products: SparkFun LSM9DS1 Breakout <https://www.sparkfun.com/products/13284> SparkFun PSOC <https://www.sparkfun.com/products/13714> SparkFun Load Cell Amplifier <https://www.sparkfun.com/products/13879>
U3 = SparkFun-PowerIC:V_REG_AP2112: AP2112 - 600mA CMOS LDO Regulator w/ Enable The AP2112 is CMOS process low dropout linear regulator with enable function, the regulator delivers a guaranteed 600mA (min.) continuous load current. Features Output Voltage Accuracy: ±1.5% Output Current: 600mA (Min.) Foldback Short Current Protection: 50mA Enable Function to Turn ON/OFF VOUT Low Dropout Voltage (3.3V): 250mV (Typ.) @IOUT=600mA Excellent Load Regulation: 0.2%/A (Typ.) Excellent Line Regulation: 0.02%/V (Typ.) Low Quiescent Current: 55μA (Typ.) Low Standby Current: 0.01μA (Typ.) Low Output Noise: 50μVRMS PSRR: 100Hz -65dB, 1kHz -65dB OTSD Protection Stable with 1.0μF Flexible Cap: Ceramic, Tantalum and Aluminum Electrolytic Operation Temperature Range: -40°C to 85°C ESD: MM 400V, HBM 4000V; PROD_ID: VREG-12457; VALUE: 3.3V
U4 = Testing:ARTEMIS_MODULE
U5 = SparkFun-IC-Comms:CH340C; PROD_ID: IC-14038
U$16 = SparkFun-Aesthetics:OSHW-LOGO: Open-Source Hardware (OSHW) Logo This logo indicates the piece of hardware it is found on incorporates a OSHW license and/or adheres to the definition of open source hardware found here: http://freedomdefined.org/OSHW
Y1 = SparkFun-Clocks:CRYSTAL-32.768KHZ: 32.768kHz Crystal Frequency: 32.768kHz Frequency Stability: ±20ppm Load Capacitance: 12.5pF (PTH-2X6 & SMD-3.2X1.5), 6pF (SMD-2X6) SparkFun Products: SparkFun BigTime Watch Kit <https://www.sparkfun.com/products/11734> SparkFun nRF52832 Breakout <https://www.sparkfun.com/products/13990> SparkFun Real Time Clock Module <https://www.sparkfun.com/products/12708>; PROD_ID: XTAL-13062

## Net classes
0 default: width 0 mm, drill 0 mm
1 power: width 0.762 mm

## Board
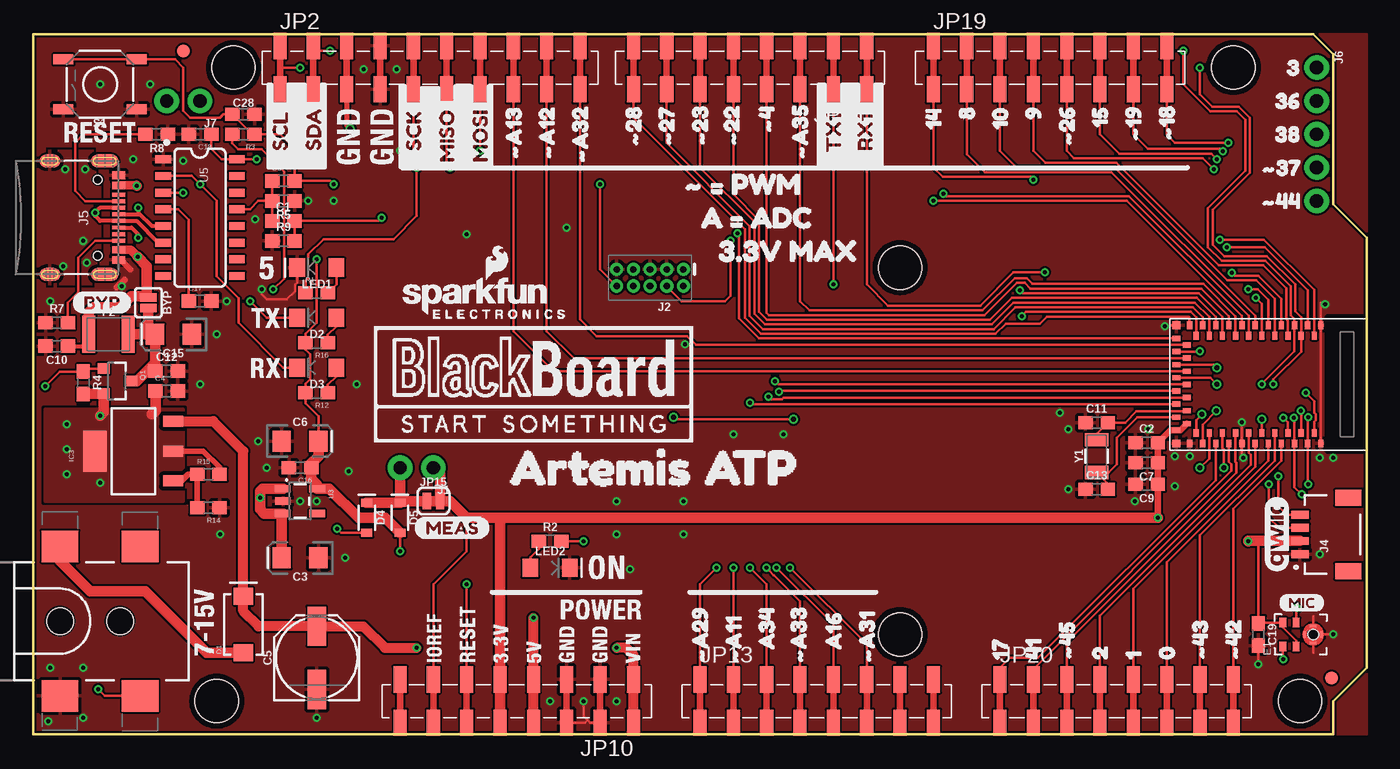
[diagram p2: board, top side]
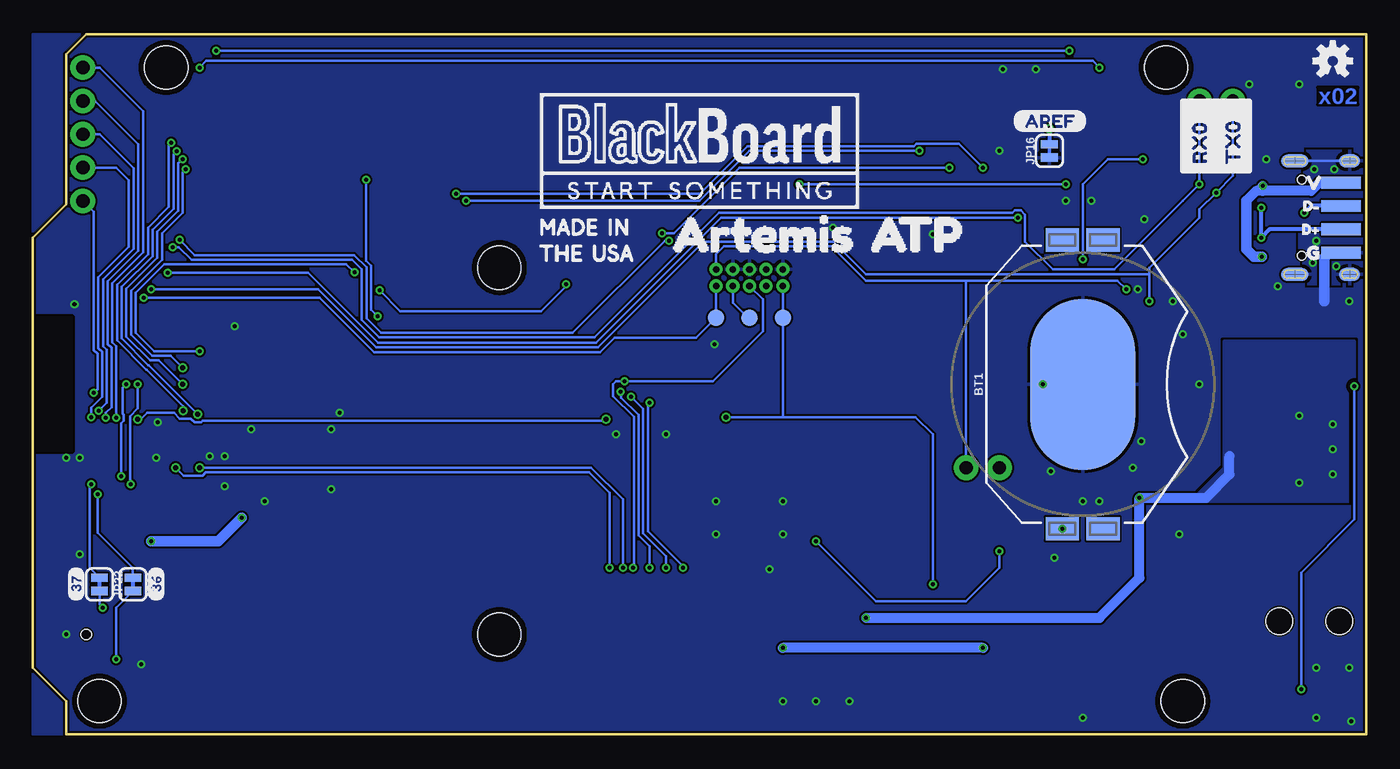
[diagram p3: board, bottom side, seen from below]

Size 101.6 x 53.34 mm. Coordinates in mm from the lower left corner, seen from the top.
Outline: 0,53.34 97.54,53.34 99.06,51.82 99.06,40.39 101.6,37.85 101.6,5.08 99.06,2.54 99.06,0 0,0 0,53.34
Copper layers (1*16): Top 0.035mm / dielectric 1.5mm / Bottom 0.035mm
Design rules "SparkFun-2-layer-PCBWay-LIMIT": minimum track width 6mil, minimum drill 0.3mm, track to track 6mil, track to pad 6mil, pad to pad 6mil, via to via 6mil, smd to smd 6mil, copper to edge 6mil, drill to drill 6mil, minimum pad ring 6mil, minimum via ring 6mil, stop-mask expansion 4mil, vias tented up to drill 25mil, thermal gap 10mil
tRestrict: area 98.6,21.6 to 101.8,31.8
bRestrict: area 98.6,21.6 to 101.8,31.8
vRestrict: area 0.6,22.4 to 2,30.6; area 5.7,23.1 to 7.4,30.6; area 47.9,10.8 to 48.5,11.3; area 50.4,10.7 to 50.9,11.6; area 11.3,29.3 to 12.7,31.6; area 0.3,13 to 9.4,25

### Footprints (pad centres in the part's own frame; a part is rotated, then mirrored left to right if it is on the bottom)
BATTCON_20MM_4LEGS_OVERPASTE = smd 1.778 x 2.54: 1 -11,1.55; 3 11,1.55; P$1 -11,-1.55; P$2 11,-1.55 | smd 13 x 8: 2 0,0
SMT-JUMPER_2_NO_SILK = smd 0.635 x 1.27: 1 -0.406,0; 2 0.406,0
0603 = smd 1.1 x 1: 1 -0.85,0; 2 0.85,0
EIA3216 = smd 1.4 x 1.6: + 1.4,0; - -1.4,0
PANASONIC_D = smd 3 x 1.4: + 2.4,0; - -2.4,0
SMA-DIODE = smd 1.27 x 1.47: A -2.15,0; C 2.15,0
LED-1206 = smd 1.2 x 1.4: A -1.5,0; C 1.5,0
SOD-323 = smd 0.63 x 0.83: A 1.15,0; C -1.15,0
SPH0641LM4H-1_MICROPHONE = smd 0.725 x 0.522: 1 -0.9,1.3; 2 -0.9,0.3; 4 0.9,0.3; 5 0.9,1.3 | smd 0.5 x 0.2: 3 0,-1.65; 8 0,-0.35 | smd 0.2 x 0.5: 6 -0.65,-1; 7 0.65,-1 | hole 0.8: 0,-1
1210 = smd 1 x 2.8: 1 -1.5,0; 2 1.5,0
SOT223-ALT1 = smd 0.838 x 1.524: 1 -2.271,-3.02; 2 0,-3.02; 3 2.288,-3.02 | smd 3.124 x 1.778: 4 0,2.921
1X02_NO_SILK = drill 1.016 pad 1.88: 1 0,0; 2 2.54,0
2X5-PTH-1.27MM-NO_SILK = drill 0.508 pad 1: 1 -2.54,-0.635; 2 -2.54,0.635; 3 -1.27,-0.635; 4 -1.27,0.635; 5 0,-0.635; 6 0,0.635; 7 1.27,-0.635; 8 1.27,0.635; 9 2.54,-0.635; 10 2.54,0.635
POWER_JACK_SMD_OVERPASTE_TOE = smd 2.8 x 2.4: GND 0,-5.7; P$4 6.1,-5.7; VIN0 0,5.7; VIN1 6.1,5.7 | hole 2.032: 0,0; 4.572,0
JST04_1MM_RA = smd 0.6 x 1.35: 1 -1.5,0; 2 -0.5,0; 3 0.5,0; 4 1.5,0 | smd 1.2 x 2: NC1 2.8,-3.675; NC2 -2.8,-3.675
USB-C-16P = smd 0.3 x 1.016: A5 -1.25,0.154; A6 -0.25,0.154; A7 0.25,0.154; A8 1.25,0.154; B5 1.75,0.154; B6 0.75,0.154; B7 -0.75,0.154; B8 -1.75,0.154 | smd 0.6 x 1.016: GND -3.225,0.154; GND2 3.225,0.154 | smd 1 x 2.1: SHLD1 -4.32,-0.915; SHLD2 4.32,-0.915 | smd 1 x 2.1 bottom: SHLD3 -4.32,-0.915; SHLD4 4.32,-0.915 | smd 1 x 1.6: SHLD5 -4.32,-5.095; SHLD8 4.32,-5.095 | smd 1 x 1.6 bottom: SHLD6 -4.32,-5.095; SHLD7 4.32,-5.095 | smd 0.55 x 1.016: VBUS1 -2.45,0.154; VBUS2 2.45,0.154 | hole 0.65: -2.89,-1.445; 2.89,-1.445
1X05_NO_SILK = drill 1.016 pad 1.88: 1 0,0; 2 2.54,0; 3 5.08,0; 4 7.62,0; 5 10.16,0
1X10_SMD_COMBINED = smd 1 x 2: 1A 0,1.65; 1B 0,-1.65; 2A 2.54,1.65; 2B 2.54,-1.65; 3A 5.08,1.65; 3B 5.08,-1.65; 4A 7.62,1.65; 4B 7.62,-1.65; 5A 10.16,1.65; 5B 10.16,-1.65; 6A 12.7,1.65; 6B 12.7,-1.65; 7A 15.24,1.65; 7B 15.24,-1.65; 8A 17.78,1.65; 8B 17.78,-1.65; 9A 20.32,1.65; 9B 20.32,-1.65; 10A 22.86,1.65; 10B 22.86,-1.65
STAND-OFF = hole 3.302: 0,0
FIDUCIAL-1X2 = smd 1 x 1: 1 0,0
1X08_SMD_COMBINED = smd 1 x 2: 1A 0,1.65; 1B 0,-1.65; 2A 2.54,-1.65; 2B 2.54,1.65; 3A 5.08,1.65; 3B 5.08,-1.65; 4A 7.62,-1.65; 4B 7.62,1.65; 5A 10.16,1.65; 5B 10.16,-1.65; 6A 12.7,-1.65; 6B 12.7,1.65; 7A 15.24,1.65; 7B 15.24,-1.65; 8A 17.78,-1.65; 8B 17.78,1.65
USB-SOLDER-PADS = smd 3 x 0.9: D+ 0,-0.889; D- 0,0.889; GND 0,-2.667; VBUS 0,2.667
SMT-JUMPER_2_NC_TRACE_SILK = smd 0.635 x 1.27: 1 -0.508,0; 2 0.508,0
SOT23-3 = smd 0.8 x 0.9: 1 -0.95,-1; 2 0.95,-1; 3 0,1.1
TACTILE_SWITCH_SMD_5.2MM = smd 1.524 x 0.762: 1 -2.794,1.905; 2 2.794,1.905; 3 -2.794,-1.905; 4 2.794,-1.905
PAD.03X.05 = smd 1.27 x 1.27: P$1 0,0
SOT23-5 = smd 0.55 x 1.2: 1 -0.95,-1.3; 2 0,-1.3; 3 0.95,-1.3; 4 0.95,1.3; 5 -0.95,1.3
ARTEMIS_FP = smd 0.4 x 0.6: AD16 -4,-3.7; BOOT 1.5,4.5; D0 0.5,-4.5; D1 -0.5,-4.5; D2 -1,-3.7; D3 2,-3.7; D7 -1.5,4.5; D8 -0.5,4.5; D9 2,3.7; D10 1,3.7; D14 -5,3.7; D17 -3.5,-4.5; D36 2.5,-4.5; D38 3,-3.7; D40 2.5,4.5; D41 -2.5,-4.5; GND@1 4.5,4.5; GND@39 -5.5,-4.5; GND@47 -1.5,-4.5; GND@59 4.5,-4.5; RXI-0 3.5,4.5; SWDCK 4,3.7; SWDIO 0,3.7; TXO-0 0.5,4.5; ~AD31 -3,-3.7; ~AD35 -2,3.7; ~D4 -2.5,4.5; ~D5 -1,3.7; ~D18 -4.5,-4.5; ~D19 -5,-3.7; ~D22 -3.5,4.5; ~D23 -4,3.7; ~D24 -3,3.7; ~D27 -4.5,4.5; ~D28 -5.5,4.5; ~D37 3.5,-4.5; ~D39 3,3.7; ~D42 1.5,-4.5; ~D43 1,-3.7; ~D44 4,-3.7; ~D45 -2,-3.7; ~RST 0,-3.7 | smd 0.6 x 0.4: AD34 -6.5,-0.5; D15 -6.5,0.5; VDD@36 -5.7,-3; VDD@37 -6.5,-3.5; XI -6.5,-2.5; XO -5.7,-2; ~AD11 -5.7,-1; ~AD12 -5.7,2; ~AD13 -5.7,1; ~AD29 -6.5,-1.5; ~AD32 -5.7,3; ~AD33/SWO -5.7,0; ~D6 -6.5,3.5; ~D25 -6.5,2.5; ~D26 -6.5,1.5 | smd 0.6 x 0.6: GND@22 -6.5,4.5; GND@38 -6.5,-4.5
SO016 = smd 0.6 x 1.2: 1 -4.445,-2.8; 2 -3.175,-2.8; 3 -1.905,-2.8; 4 -0.635,-2.8; 5 0.635,-2.8; 6 1.905,-2.8; 7 3.175,-2.8; 8 4.445,-2.8; 9 4.445,2.8; 10 3.175,2.8; 11 1.905,2.8; 12 0.635,2.8; 13 -0.635,2.8; 14 -1.905,2.8; 15 -3.175,2.8; 16 -4.445,2.8
CRYSTAL-SMD-3.2X1.5MM = smd 1 x 1.8: P$1 -1.25,0; P$2 1.25,0

### Placement (x,y rotation side)
BT1  21.59,26.67 90 bottom
BYP  8.76,32.89 270 top
C1  19.05,39.12 0 top
C2  84.84,22.23 0 top
C3  20.32,13.46 180 top
C4  10.16,26.16 0 top
C5  21.59,5.84 90 top
C6  20.32,22.35 0 top
C7  84.84,20.7 180 top
C8  19.05,42.16 0 top
C9  84.84,19.05 180 top
C10  1.78,29.59 180 top
C11  81.03,23.75 0 top
C12  10.16,27.69 0 top
C13  81.03,18.67 0 top
C15  10.67,30.48 180 top
C16  20.32,20.32 180 top
C17  12.7,33.02 0 top
C18  12.7,45.72 180 top
C19  93.34,7.62 270 top
C28  16,47.24 0 top
D1  16,8.38 90 top
D2  21.59,31.75 180 top
D3  21.59,27.94 180 top
D4  25.4,16.51 270 top
D5  27.94,16.51 270 top
E1  96.52,7.62 90 top
F2  5.71,30.48 0 top
FRAME1  -5.08,-38.1 0 top  (outside the outline)
FRAME2  36.83,21.59 270 bottom
IC3  7.62,21.59 90 top
J1  30.48,20.32 180 top
J2  46.99,34.8 180 top
J3  2.03,8.64 0 top
J4  96.52,15.24 90 top
J5  6.35,39.37 270 top
J6  97.79,50.8 270 top
J7  12.7,48.26 180 top
JP1  33.66,33.4 0 top
JP2  18.8,50.8 0 top
JP3  13.97,2.54 0 top
JP4  66.04,7.62 0 top
JP5  66.04,35.56 0 top
JP6  15.24,50.8 0 top
JP7  35.31,35.94 0 top
JP8  98.93,4.32 0 top
JP9  11.43,52.07 0 top
JP10  45.72,2.54 180 top
JP11  63.5,50.8 180 top
JP13  50.8,2.54 0 top
JP14  1.91,39.37 0 bottom
JP15  30.48,17.78 0 top
JP16  24.13,44.45 90 bottom
JP17  STAND-OFF  [STAND-OFF]  96.52,2.54 0 top
JP18  STAND-OFF  [STAND-OFF]  91.44,50.8 0 top
JP19  68.58,50.8 0 top
JP20  73.66,2.54 0 top
JP21  93.98,11.43 270 bottom
JP22  96.52,11.43 270 bottom
LED1  21.59,35.56 180 top
LED2  39.37,12.7 0 top
Q1  6.35,26.92 270 top
R1  21.59,33.66 0 top
R2  39.37,14.73 0 top
R3  16,45.72 180 top
R4  3.81,26.8 270 top
R5  19.05,40.64 180 top
R7  1.78,31.37 0 top
R8  9.4,45.72 180 top
R9  19.05,37.59 0 top
R12  21.59,26.04 180 top
R14  13.34,17.27 180 top
R15  13.34,19.81 0 top
R16  21.59,29.84 180 top
S1  5.08,49.53 180 top
TP1  46.99,31.75 90 bottom
TP2  49.53,31.75 90 bottom
TP3  44.45,31.75 0 bottom
U3  20.32,17.78 270 top
U4  93.6,26.67 0 top
U5  12.7,39.37 270 top
U$1  [BLACKBOARDLOGO#PNG]  38.1,26.67 0 top
U$2  [D#3]  5.59,38.48 0 bottom
U$3  [BLACKBOARDLOGO#PNG]  50.8,44.45 0 bottom
U$4  [MADEINUSA#PNG]  59.44,37.59 0 bottom
U$9  [QWIIC_COPYRIGHT_SMALL]  94.74,15.24 90 top
U$10  [D#4]  5.46,40.26 0 bottom
U$11  [G1]  5.46,36.7 0 bottom
U$12  [V0]  5.46,42.04 0 bottom
U$13  [#A332]  58.29,4.45 90 top
U$14  [ARTEMIS0]  34.04,20.32 0 top
U$15  [ARTEMIS0]  55.12,38.1 0 bottom
U$16  2.54,51.31 0 bottom
U$17  [A160]  60.96,5.46 90 top
U$18  [SCL1]  18.8,43.43 90 top
U$19  [#48]  55.88,44.83 90 top
U$20  [AREF2]  26.92,46.74 0 bottom
U$21  [#229]  53.21,43.81 90 top
U$22  [SDA0]  21.34,43.43 90 top
U$23  [#3711]  92.58,43.18 0 top
U$24  [#187]  86.36,44.2 90 top
U$25  [#2310]  50.8,43.81 90 top
U$26  [#2711]  48.26,43.81 90 top
U$27  [#2812]  45.72,43.81 90 top
U$28  [ATP1]  40.01,38.1 0 bottom
U$29  [#A113]  53.34,4.45 90 top
U$30  [#A294]  50.8,4.45 90 top
U$31  [#A310]  63.5,4.45 90 top
U$32  [#196]  83.82,44.2 90 top
U$33  [#A357]  58.42,42.8 90 top
U$34  [#A1214]  39.12,42.8 90 top
U$35  [#A1315]  36.58,42.8 90 top
U$36  [#A3213]  41.66,42.55 90 top
U$37  [#264]  78.74,43.81 90 top
U$38  [A342]  55.88,5.46 90 top
U$39  [#4213]  91.44,4.7 90 top
U$40  [#4314]  88.9,4.7 90 top
U$41  [#4412]  92.58,40.64 0 top
U$42  [#4518]  78.74,4.7 90 top
U$43  [015]  86.36,4.7 90 top
U$44  [38]  94.49,50.8 0 top
U$45  [81]  71.12,45.85 90 top
U$46  [93]  76.2,45.85 90 top
U$47  [MISO8]  31.5,42.55 90 top
U$48  [MOSI7]  34.04,42.55 90 top
U$49  [RX01]  12.7,42.42 90 bottom
U$50  [SCK9]  28.96,43.43 90 top
U$51  [102]  73.66,45.09 90 top
U$52  [116]  83.82,4.7 90 top
U$53  [TX00]  10.16,42.42 90 bottom
U$54  [140]  68.58,45.09 90 top
U$55  [155]  81.28,45.21 90 top
U$56  [217]  81.28,4.7 90 top
U$57  [369]  93.6,48.26 0 top
U$58  [1720]  73.66,4.7 90 top
U$59  [3810]  93.6,45.72 0 top
U$60  [4119]  76.2,4.7 90 top
U$61  [ATP1]  48.9,20.32 0 top
U$62  [MIC0]  94.87,10.03 0 top
U$63  [364]  92.2,10.16 90 bottom
U$64  [373]  98.3,10.16 90 bottom
U$66  [#_#_PWM7]  48.26,41.91 0 top
U$67  [3#3V_MAX2]  50.8,36.83 0 top
U$68  [BYP0]  2.92,32.89 0 top
U$69  [A_#_ADC6]  49.53,39.37 0 top
U$70  [MEAS3]  28.96,15.75 0 top
U$71  [RX11]  63.37,43.43 90 top
U$72  [TX10]  60.96,43.31 90 top
Y1  81.03,21.21 90 top

### Tracks (layer width: path | path; a pad name or v marks a point on that pad's centre or on a via)
3.3V  (via drill 0.3)
  Top 0.203: v17.02,43.81 U5.16 14.35,43.81 13.55,44.62 C18.1 | C6.+ 21.72,24.25 20.74,25.23 R12.2 20.74,26.71 21.08,27.05 21.08,28.96 20.74,29.3 R16.2 20.74,30.52 21.59,31.37 v21.59,36.2 | R2.2 v41.91,14.73 | v27.94,13.97 D5.A
  Top 0.508: 21.59,18.76 U3.5
  Top 0.813: C6.+ 21.72,21.21 21.17,20.66 C16.1 21.17,19.47 21.59,19.05 21.59,18.76 | U3.5 22.55,18.73 24.77,16.51 26.79,16.51 D5.A
  Bottom 0.203: v17.02,43.81 19.68,43.81 21.59,41.91 v21.59,36.2 | v41.91,14.73 37.34,10.16 30.48,10.16 27.94,12.7 v27.94,13.97
5V  (via drill 0.3)
  Top 0.406: IC3.2 12.95,21.59 14.19,20.36 R15.2
  Top 0.508: 18.92,16.73 U3.3
  Top 0.762: JP10.4B JP10.4A v38.1,8.89
  Top 0.813: C3.+ 18.92,16.73 | v5.08,24.27 5.35,24.54 Q1.2 3.84,25.97 R4.2 | U3.3 17.59,16.83 17.27,17.14 v17.27,18.03 17.27,18.54 17.46,18.73 U3.1 | C4.1 9.31,24.68 9.02,24.38
  Bottom 0.762: v38.1,8.89 20.32,8.89 17.27,11.94 v17.27,18.03 12.19,18.03 10.41,19.81 10.41,21.21
  other vias: 2.54,21.73 5.08,19.19 2.54,19.82 2.54,23.63
  pour Bottom (isolate 0.305, no thermals): 0.89,29.97 10.79,29.97 10.79,20.32 12.7,18.41 12.7,17.78 0.89,17.78
  pour Top (isolate 0.305, no thermals): 0.89,17.78 0.89,24.77 11.43,24.77 11.43,17.78
!DTR
  Top 0.203: R5.2 C1.1 | U5.13 16.51,40.01 17.14,40.64 R5.2 | C8.1 R5.2
!RESET  (via drill 0.3, 0.38)
  Top 0.203: JP10.6B JP10.6A v33.02,11.43 | S1.4 S1.3 10.79,51.44 11.43,50.8 11.43,47.5 11.94,46.99 14.22,46.99 14.48,47.24 C28.1 16.68,45.72 R3.1 18.8,45.72 19.9,44.62 C8.2 22.61,42.16 v22.86,41.91 | v43.18,41.91 43.18,35.43 J2.10 | U4.~RST v93.6,24 | v48.77,24.17 48.94,24 v57.91,24
  Bottom 0.203: v22.86,41.91 v43.18,41.91 | v33.02,11.43 33.02,22.86 34.33,24.17 44.45,24.17 | TP3.P$1 J2.10 44.45,24.17 | 44.45,24.17 v48.77,24.17 | v93.6,24 93.4,24 92.9,24.5 90.83,24.5 90.39,24.06 89.55,24.06 89.27,23.79 88.78,23.79 88.67,23.9 58.02,23.9 v57.91,24
AD16  (via drill 0.3, 0.38)
  Top 0.203: v56.64,12.7 60.96,8.38 JP13.5A JP13.5B | U4.AD16 89.6,21.02 v88.9,20.32
  Bottom 0.203: v56.64,12.7 56.64,17.91 59.05,20.32 v88.9,20.32
AD34  (via drill 0.3)
  Top 0.203: U4.AD34 56.88,26.17 v56.82,26.11 | v54.61,12.7 55.88,11.43 JP13.3A JP13.3B
  Bottom 0.203: v54.61,12.7 54.61,14.35 55.45,15.19 55.45,24.34 56.77,25.66 56.77,26.06 v56.82,26.11
BOOT  (via drill 0.3)
  Top 0.203: R9.2 C1.2 26.29,39.12 v26.54,39.37 | v91.32,35.18 91.55,34.95 93.34,34.95 95.1,33.19 U4.BOOT
  Bottom 0.203: v26.54,39.37 49.15,39.37 58.67,29.84 75.3,29.84 80.64,35.18 v91.32,35.18
CC1
  Top 0.203: J5.A5 3.96,40.62 3.17,41.4 3.17,45.09 3.81,45.72 R8.2
CC2
  Top 0.203: J5.B5 4.73,37.62 3.43,36.32 3.43,33.69 2.63,32.89 R7.2
D0
  Top 0.203: U4.D0 94.1,20.87 86.36,13.13 JP20.6B JP20.6A
D1
  Top 0.203: U4.D1 93.1,21.48 93.12,21.46 93.12,20.39 83.82,11.09 JP20.5A JP20.5B
D2
  Top 0.203: U4.D2 92.6,21.48 92.76,21.31 92.76,20.54 81.28,9.05 JP20.4B JP20.4A
D3  (via drill 0.3)
  Top 0.203: U4.D3 95.6,23.78 v95.25,24.13
  Bottom 0.203: J6.1 96.52,50.8 93.18,47.46 93.18,36.74 95.53,34.39 95.53,29.87 95.25,29.59 v95.25,24.13
D8
  Top 0.203: JP19.2B JP19.2A 71.12,44.2 72.49,42.82 82.16,42.82 93.1,31.89 U4.D8
D9
  Top 0.203: JP19.4B JP19.4A 76.2,44.45 77.11,43.54 82.54,43.54 90.34,35.74 93.71,35.74 95.45,33.99 95.45,31.67 95.6,31.53 U4.D9
D10
  Top 0.203: JP19.3A JP19.3B 73.66,44.45 74.93,43.18 82.39,43.18 90.98,34.59 93.19,34.59 94.6,33.19 U4.D10
D14  (via drill 0.3)
  Top 0.203: JP19.1A JP19.1B 68.58,43.18 69.29,42.47 76,42.47 v76.2,42.27 | U4.D14 88.6,31.8 88.2,32.19 75.64,32.19 v75.31,31.86
  Bottom 0.203: v75.31,31.86 75.82,32.37 75.82,35.72 76.2,36.1 v76.2,42.27
D15  (via drill 0.3, 0.38)
  Top 0.203: U4.D15 89.67,27.17 v90.17,26.67 | v90.18,43.81 89.74,44.25 82.75,44.25 81.28,45.72 JP19.6A JP19.6B
  Bottom 0.203: v90.17,26.67 92,28.5 92.65,28.5 94.47,30.32 94.47,33.95 92.11,36.3 92.11,38.31 90.53,39.9 90.53,43.53 90.25,43.81 v90.18,43.81
D17
  Top 0.203: U4.D17 90.1,19.38 76.56,5.84 74.42,5.84 73.66,5.08 JP20.1A JP20.1B
D36  (via drill 0.3)
  Top 0.203: v96.03,24.14 96.1,24.07 U4.D36 96.1,18.84 v96.65,18.29
  Bottom 0.203: J6.2 96.88,48.26 93.57,44.96 93.57,36.85 95.89,34.54 95.89,29.73 95.61,29.44 95.61,24.92 96.03,24.5 v96.03,24.14 | v96.65,18.29 96.65,15.37 93.98,12.7 JP21.1
D38  (via drill 0.3)
  Top 0.203: U4.D38 96.6,24.65 v96.58,24.66
  Bottom 0.203: J6.3 96.52,45.72 93.93,43.13 93.93,37 96.24,34.69 96.24,29.58 95.96,29.3 95.96,25.29 v96.58,24.66
D40/SDA  (via drill 0.3)
  Top 0.203: v87.63,52.07 87.63,49.53 89.68,47.48 91.69,47.48 92.35,46.82 92.35,42.95 89.51,40.1 89.51,37.12 90.54,36.09 93.86,36.09 95.81,34.14 95.81,31.94 96.1,31.65 U4.D40 96.1,29.21 93.6,26.71 v93.6,26.67 | J4.3 94.93,15.74 94.16,16.51 v94.16,19.05 | v22.61,52.07 21.34,52.07 | JP2.2A JP2.2B
  Top 0.254: 21.34,52.07 JP2.2A
  Bottom 0.203: v93.6,26.67 93.6,24.85 94.2,24.25 94.2,19.21 94.16,19.18 v94.16,19.05 | v87.63,52.07 v22.61,52.07
D41
  Top 0.203: U4.D41 91.1,20.76 91.29,20.57 91.29,20.07 76.2,4.98 JP20.2B JP20.2A
D+  (via drill 0.3)
  Top 0.305: J5.A6 8.01,39.62 8.01,39.75 | 8.01,39.75 9.02,38.73 U5.5 | J5.B6 7.48,38.62 8,38.1 v8,37.85 | v8,40.13 v8.01,40.13 8.01,39.75
  Bottom 0.305: v8,40.13 v8,37.85 7.37,38.48 JP14.D+
D-  (via drill 0.3)
  Top 0.305: J5.B7 5.07,40.12 v4.7,39.75 v4.71,39.74 4.71,39.5 5.08,39.12 J5.A7 7.87,39.12 9.53,37.47 U5.6
  Bottom 0.305: JP14.D- 4.19,40.26 v4.7,39.75
GND  (via drill 0.3)
  Top 0.203: JP10.2B 42.42,0.89 42.23,1.08 | 42.23,1.08 41.91,1.4 v41.91,2.54 | JP10.3A 42.04,0.89 42.23,1.08 | LED1.C 20.09,34.41 19.94,34.26 19.94,33.78 19.3,33.15 17.78,33.15 17.4,33.53 v17.4,33.91 | U4.GND@22 86.29,31.17 v86.23,31.11 | v92.2,21.08 92.1,21.18 U4.GND@47 v92.1,23.78 | E1.7 97.3,8.27 96.89,7.86 96.89,7.64 E1.8 96.87,7.4 97.3,6.97 E1.6 | E1.7 97.78,8.27 98.17,7.88 E1.3 | E1.3 98.17,7.37 97.78,6.97 E1.6 | E1.6 97.52,6.22 | E1.7 97.52,9.02 | C19.2 v93.34,5.33 | E1.3 v99.06,7.62 | 98.1,32.9 U4.GND@1 U4.GND@59
  Top 0.508: 6.94,34.65 6.35,34.06 | 6.65,36.15 7.37,35.43
  Bottom 0.813: JP14.GND 2.79,36.7 3.17,36.32 3.17,33.02
  other vias: 5.08,49.53 27.69,50.67 1.27,5.08 27.94,44.45 17.78,20.32 14.22,15.24 6.73,34.16 13.97,30.48 14.73,33.02 12.7,26.67 11.43,43.69 8.89,49.53 23.75,13.46 7.62,43.81 1.27,33.02 20.32,17.78 21.59,17.78 24,20.07 17.14,22.35 3.81,1.27 3.81,5.08 1.14,1.02 21.59,1.27 44.45,2.54 39.37,2.54 16.89,39.24 22.86,40.64 20.95,40.64 45.47,12.57 25.15,50.67 24.64,26.67 33.02,38.1 40.64,38.61 44.45,17.78 49.53,17.78 49.66,29.72 87,21.21 88.14,21.21 87,18.92 98.04,21.08 99.06,21.08 98.04,13.72 78.87,18.67 78.87,23.24 83.95,17.78 84.96,23.24 78.23,24.51 98.42,32.77 57.15,22.86 53.34,22.86 49.53,15.24 44.45,15.24
  pour Top (isolate 0.152, rank 2): 0,53.34 101.6,53.34 101.6,0 0,0
  pour Bottom (isolate 0.152, rank 2): 0,53.34 101.6,53.34 101.6,0 0,0
INSERT  (via drill 0.3)
  Top 0.203: J3.P$4 5.45,2.94 v4.95,3.43 | R4.1 1.99,27.65 v0.89,26.54 | Q1.1 4.04,27.87
  Top 0.305: 4.04,27.87 R4.1
  Bottom 0.203: v4.95,3.43 4.95,12.32 0.89,16.38 v0.89,26.54
N$1
  Top 0.203: R1.2 23.09,34.3 LED1.A
N$2
  Top 0.203: R2.1 38.52,14.14 37.87,13.49 LED2.A
N$3
  Top 0.203: JP15.1 29.72,17.78
  Top 0.813: D4.C D5.C | D5.C 28.06,17.78 29.72,17.78 | J1.2 D5.C
N$4
  Top 0.813: 30.1,17.78 30.86,17.78
N$5
  Top 0.203: R16.1 22.44,30.44 23.09,31.09 D2.A
N$6
  Top 0.203: U5.4 11.05,40.01 11.85,39.2 C17.1
N$7
  Top 0.203: Y1.P$2 81.03,22.9 C11.2 83.19,23.75 84.06,24.62 87.85,24.62 U4.XO
N$8
  Top 0.203: U4.XI 84.11,24.17 82.55,22.61 82.55,20.57 81.94,19.96 Y1.P$1 81.88,19.11 C13.2
N$9
  Top 0.203: R12.1 22.44,26.63 23.09,27.28 D3.A
N$10  (via drill 0.38)
  Top 0.381: JP2.3A JP2.3B 23.88,46.38 v24.13,46.13
  Bottom 0.305: v24.13,46.13 JP16.2
N$15
  Top 0.406: IC3.1 11.32,19.32 11.81,19.81 R15.1 R14.2
PDMCLK  (via drill 0.3)
  Top 0.203: E1.4 96.22,9.61 v96.27,9.65
  Bottom 0.203: JP22.2 96.52,9.91 v96.27,9.65
PDMDATA  (via drill 0.3)
  Top 0.203: E1.1 95.22,5.75 v95.25,5.71
  Bottom 0.203: JP21.2 95.25,9.65 v95.25,5.71
PWRIN
  Top 0.813: J3.VIN0 2.03,13.21 4.32,10.92 8.51,10.92 13.2,6.23 D1.A
RXI-0  (via drill 0.3)
  Top 0.178: U5.2 12.06,42.55 v12.7,41.91
  Top 0.203: v12.7,41.91 13.97,40.64 13.97,34.9 15.62,33.24 15.62,31.37 19.05,27.94 D3.C | v90.94,37.13 93.83,37.13 97.1,33.86 U4.RXI-0
  Bottom 0.203: J7.1 v12.7,41.91 13.97,40.64 19.18,35.43 23.88,35.43 25.98,37.54 25.98,39.6 26.31,39.93 26.77,39.93 26.95,39.75 49.31,39.75 58.81,30.25 75.2,30.25 76.53,31.57 76.53,35.43 77.27,36.17 89.51,36.17 90.47,37.13 v90.94,37.13
SHLD  (via drill 0.3)
  Bottom 0.203: J5.SHLD1 J5.SHLD5
  other vias: 2.41,43.05 3.94,43.05 3.81,37.59 4.06,35.94 2.29,35.69
  pour Bottom: 0,44.45 5.08,44.45 5.08,34.29 0,34.29
  pour Top: 0,44.45 5.08,44.45 5.08,34.29 0,34.29
SWDCK  (via drill 0.3)
  Top 0.203: U4.SWDCK 97.6,33.86 93.77,37.69 v90.42,37.69 | v53.12,37.62 53.12,33.43 52.7,33.02 49.4,33.02 J2.4
  Bottom 0.203: J2.4 48.26,32.89 47.12,31.75 TP1.P$1 | v90.42,37.69 89.26,36.52 77.13,36.52 76.17,35.57 76.17,31.72 75.06,30.61 60.45,30.61 53.43,37.62 v53.12,37.62
SWDIO  (via drill 0.3)
  Top 0.203: U4.SWDIO 93.6,32.83 v93.15,33.27
  Bottom 0.203: J2.2 TP2.P$1 51.05,30.23 57.27,30.23 58.36,29.13 75.6,29.13 79.74,33.27 v93.15,33.27
TXO-0  (via drill 0.3)
  Top 0.178: U5.3 v11.43,41.27
  Top 0.203: D2.C 17.78,31.75 v16.51,33.02 | v92.58,33.91 93.31,33.91 94.1,33.12 U4.TXO-0
  Bottom 0.203: 16.51,35.05 v16.51,33.02 | 16.51,35.05 38.1,35.05 40.58,37.53 50.48,37.53 58.53,29.49 75.45,29.49 79.87,33.91 v92.58,33.91 | 16.51,35.05 16.51,35.56 12.7,39.37 12.7,40.01 v11.43,41.27 10.16,42.55 J7.2
USBVCC
  Top 0.254: BYP.2 8.76,32.28
  Top 0.813: F2.2 C15.+ | C15.+ 8.76,30.98 8.76,32.28 | Q1.3 7.87,26.92 8.64,27.69 | 8.64,27.69 C12.1 | C15.+ 9.27,28.32 8.64,27.69
V_BATT  (via drill 0.3)
  Top 0.203: BT1.1 23.45,15.36 D4.A
  other vias: 23.14,15.67
VDD  (via drill 0.3)
  Top 0.203: 33.02,16.51 33.02,13.97 30.48,11.43 JP10.7B JP10.7A | v18.29,33.91 19.1,34.72 19.1,42.88 17.4,44.58 15.62,44.58 15.15,45.05 R3.2 | E1.2 96.22,7.16 95.22,8.16 E1.5 93.39,8.52 C19.1 93.34,14.74
  Top 0.508: v85.69,16.51 C9.1 C7.1 C2.2 86.63,23.17 U4.VDD@37 87.4,23.17 U4.VDD@36
  Top 0.762: JP10.5B JP10.5A
  Top 0.813: 35.56,16.51 33.02,16.51 31.75,17.78 JP15.2 30.99,19.81 J1.1 | JP10.5A 35.56,16.51 | 35.56,16.51 v85.69,16.51 | J4.2 93.34,14.74 v92.59,14.74 v92.58,14.73
  Bottom 0.203: J2.1 49.53,36.58 48.93,37.17 40.73,37.17 38.12,34.57 30.48,34.57 | J1.1 30.48,34.57 | 30.48,34.57 18.95,34.57 v18.29,33.91
  Bottom 0.813: v92.58,14.73 87.46,14.73 v85.69,16.51
VIN  (via drill 0.3)
  Top 0.762: IC3.3 13.72,23.88 16,21.59 D1.C 16,9.4 17.16,8.24 C5.+ 25.14,8.24 26.79,6.59 v29.2,6.59 | JP10.1A JP10.1B 45.72,6.1 45.21,6.6 45.2,6.59 v44.44,6.59
  Bottom 0.762: v29.2,6.59 v44.44,6.59
VUSB  (via drill 0.3)
  Top 0.254: 8.76,33.4 BYP.1 8.64,33.43
  Top 0.305: C10.1 3.94,29.59 3.94,30.2 F2.1
  Top 0.635: J5.VBUS2 7.4,36.92 v7.94,36.39 | J5.VBUS1 7.84,41.82
  Top 0.762: 7.84,41.82 v7.87,41.78
  Top 0.813: F2.1 4.21,32.16 4.61,32.55 6.6,32.55 7.46,33.4 8.76,33.4 | v7.94,36.39 8.64,35.69 8.64,33.43
  Bottom 0.762: JP14.VBUS 3.56,42.04 4.19,41.4 7.87,41.4 | 9.14,40.64 8.38,41.4 7.87,41.4 | v7.87,41.78 7.87,41.4
  Bottom 0.813: 9.14,40.64 9.14,36.96 8.57,36.39 v7.94,36.39
~AD11  (via drill 0.3)
  Top 0.203: U4.~AD11 57.17,25.67 57.05,25.55 56.18,25.55 v56.01,25.73 | v53.34,12.7 JP13.2B JP13.2A
  Bottom 0.203: v53.34,12.7 53.34,13.59 55.09,15.35 55.09,24.81 v56.01,25.73
~AD12
  Top 0.203: JP2.9A JP2.9B 39.12,30.73 41.18,28.67 U4.~AD12
~AD13
  Top 0.203: JP2.8A JP2.8B 36.58,30.73 39.64,27.67 U4.~AD13
~AD29  (via drill 0.3)
  Top 0.203: v52.07,12.7 50.8,11.43 JP13.1A JP13.1B | v54.61,25.27 54.71,25.17 U4.~AD29
  Bottom 0.203: v54.61,25.27 54.74,25.15 54.74,15.49 52.07,12.83 v52.07,12.7
~AD31  (via drill 0.3, 0.38)
  Top 0.203: v57.66,12.7 63.5,6.86 JP13.6B JP13.6A | v90.7,20.32 90.7,21.71 90.6,21.81 U4.~AD31
  Bottom 0.203: v90.7,20.32 90.1,19.72 88.65,19.72 88.41,19.96 59.21,19.96 57.66,18.41 v57.66,12.7
~AD32
  Top 0.203: JP2.10A JP2.10B 41.66,31.62 42.93,30.35 49.82,30.35 50.51,29.67 U4.~AD32
~AD33/SWO  (via drill 0.3)
  Top 0.203: v55.88,12.7 56.08,12.5 56.08,12.47 56.41,12.14 56.44,12.14 58.42,10.16 JP13.4B JP13.4A | U4.~AD33/SWO 56.77,26.67 v56.52,26.92
  Bottom 0.203: J2.6 45.97,33.15 45.97,30.73 49.78,26.92 v56.52,26.92 57.15,26.92 57.38,26.7 57.38,25.77 55.8,24.19 55.8,12.78 v55.88,12.7
~AD35
  Top 0.203: JP11.3B JP11.3A 58.42,33.02 59.14,32.3 72.33,32.3 74.79,34.76 75.69,34.76 76.13,34.33 89.15,34.33 91.6,31.88 U4.~AD35
~D4
  Top 0.203: JP11.4A JP11.4B 55.88,32.13 56.06,31.95 72.48,31.95 74.94,34.41 75.54,34.41 75.98,33.97 89,33.97 91.1,31.87 U4.~D4
~D5/SCK  (via drill 0.3)
  Top 0.203: JP2.5B 28.96,43.43 v29.21,43.18 29.21,39.5 27.43,37.72 22.1,37.72 20.94,36.56 20.94,34.76 20.74,34.55 R1.1 | v69.34,41.2 69.55,41 83.48,41 92.6,31.88 U4.~D5
  Top 0.254: JP2.5B JP2.5A
  Bottom 0.203: v29.21,43.18 31.04,45.01 34.27,45.01 34.47,44.81 47.14,44.81 50.74,41.2 v69.34,41.2
~D6/MISO  (via drill 0.3)
  Top 0.203: JP2.6A JP2.6B 31.5,43.43 v31.75,43.18 | U4.~D6 55.3,30.17 53.76,31.71 53.76,38.06 v53.63,38.19
  Bottom 0.203: v53.63,38.19 52.75,38.19 47.75,43.18 v31.75,43.18
~D7/MOSI  (via drill 0.3)
  Top 0.203: JP2.7A JP2.7B v34.04,44.45 | v68.58,40.64 83.34,40.64 92.1,31.88 U4.D7
  Bottom 0.203: v34.04,44.45 46.99,44.45 50.8,40.64 v68.58,40.64
~D18  (via drill 0.3, 0.38)
  Top 0.203: U4.~D18 89.1,23.61 v90.15,24.66 | v91.06,45.09 87,45.09 86.36,45.72 JP19.8A JP19.8B
  Bottom 0.203: v90.15,24.66 90.15,25 92.93,27.79 92.94,27.79 95.18,30.02 95.18,34.24 92.82,36.6 92.82,38.6 91.24,40.19 91.24,44.91 v91.06,45.09
~D19  (via drill 0.3, 0.38)
  Top 0.203: U4.~D19 88.6,23.96 v89.03,24.38 | v90.65,44.42 90.46,44.6 84.94,44.6 83.82,45.72 JP19.7B JP19.7A
  Bottom 0.203: v89.03,24.38 92.79,28.14 92.8,28.14 94.82,30.17 94.82,34.1 92.47,36.45 92.47,38.46 90.88,40.05 90.88,44.19 v90.65,44.42
~D22
  Top 0.203: JP11.5B JP11.5A 53.34,41.14 55.3,39.19 55.3,32.19 55.9,31.59 72.88,31.59 74.55,33.26 88.65,33.26 90.1,31.81 U4.~D22
~D23
  Top 0.203: JP11.6A JP11.6B 50.8,43.18 54.94,39.04 54.94,32.05 55.75,31.24 73.03,31.24 74.7,32.9 88.5,32.9 89.6,31.8 U4.~D23
~D24/TXO-1  (via drill 0.3)
  Top 0.203: JP11.2A JP11.2B v60.96,34.29 | U4.~D24 90.6,31.81 88.79,33.61 75.42,33.61 v75.18,33.85
  Bottom 0.203: v60.96,34.29 60.96,34.16 62.87,32.26 73.59,32.26 v75.18,33.85
~D25/RXI-1  (via drill 0.3)
  Top 0.203: JP11.1B JP11.1A 63.5,34.29 65.13,32.66 72.16,32.66 74.69,35.2 v77.09,35.2 | v88.9,29.21 88.86,29.17 U4.~D25
  Bottom 0.203: v77.09,35.2 77.71,35.81 91.59,35.81 93.75,33.66 93.75,30.61 92.36,29.21 v88.9,29.21
~D26  (via drill 0.3, 0.38)
  Top 0.203: U4.~D26 89.94,28.17 v90.17,27.94 | v89.97,43.05 89.12,43.89 79.3,43.89 78.74,44.45 JP19.5B JP19.5A
  Bottom 0.203: v90.17,27.94 91.08,28.85 92.5,28.85 94.11,30.46 94.11,33.8 91.76,36.16 91.76,38.16 90.17,39.75 90.17,42.84 v89.97,43.05
~D27
  Top 0.203: JP11.7B JP11.7A 48.26,45.06 54.59,38.73 54.59,31.9 55.6,30.88 73.18,30.88 74.84,32.55 88.35,32.55 89.1,31.8 U4.~D27
~D28
  Top 0.203: JP11.8A JP11.8B 45.72,46.99 54.23,38.48 54.23,31.75 55.45,30.53 73.33,30.53 74.11,31.3 76.69,31.3 77.22,31.84 88.06,31.84 88.1,31.79 U4.~D28
~D37  (via drill 0.3)
  Top 0.203: v97.16,24.16 97.1,24.1 U4.~D37 97.1,19.11 v97.16,19.05
  Bottom 0.203: J6.4 95.25,43.18 94.28,42.22 94.28,37.15 96.6,34.83 96.6,29.43 96.32,29.15 96.32,25.72 97.16,24.88 v97.16,24.16 | v97.16,19.05 97.28,18.92 97.28,12.7 JP22.1
~D39/SCL  (via drill 0.3)
  Top 0.203: v88.9,50.8 88.9,48.76 89.83,47.83 91.87,47.83 92.71,46.99 92.71,42.8 89.86,39.95 89.86,37.33 90.74,36.45 94.01,36.45 96.17,34.29 96.17,32.23 96.6,31.8 U4.~D39 96.6,29.17 94.49,27.06 v94.49,26.67 | v94.88,19.68 94.88,17.39 95.53,16.74 J4.4 | JP2.1A 18.8,50.8 | 18.8,50.8 JP2.1B | v20.32,50.8 18.8,50.8
  Bottom 0.203: v88.9,50.8 88.39,51.31 20.83,51.31 v20.32,50.8 | v94.49,26.67 94.75,26.4 94.75,24.43 94.69,24.36 94.69,23.9 94.88,23.71 v94.88,19.68
~D42
  Top 0.203: U4.~D42 95.1,20.86 91.44,17.2 JP20.8B JP20.8A
~D43
  Top 0.203: U4.~D43 94.6,20.86 88.9,15.16 JP20.7A JP20.7B
~D44  (via drill 0.3)
  Top 0.203: v96.95,26.04 97.6,25.39 97.6,24.51 97.72,24.39 97.72,23.93 97.6,23.81 U4.~D44
  Bottom 0.203: v96.95,26.04 96.67,26.32 96.67,29 96.95,29.28 96.95,39.8 J6.5
~D45
  Top 0.203: U4.~D45 91.6,20.76 91.65,20.71 91.65,19.93 78.74,7.02 JP20.3A JP20.3B

### Text on the board
Bottom: x02
Measures: Units in inches
214bmp: D:/SmartProjects/Snc/a4_bn_logo2.bmp